# EasyEDA Pro project ProProject_PowerDistribution_1.1.epro

# Schematic Distribution

## Sheets
1 P1: Create Date: 2023-12-11; Page Name: P1; Project Name: PowerDistribution; Schematic Name: EXTERN; Update Date: 2024-01-13; Company: INNOX; Drawed: qianwan; Page Size: A4; Reviewed: qianwan; Version: V1.1
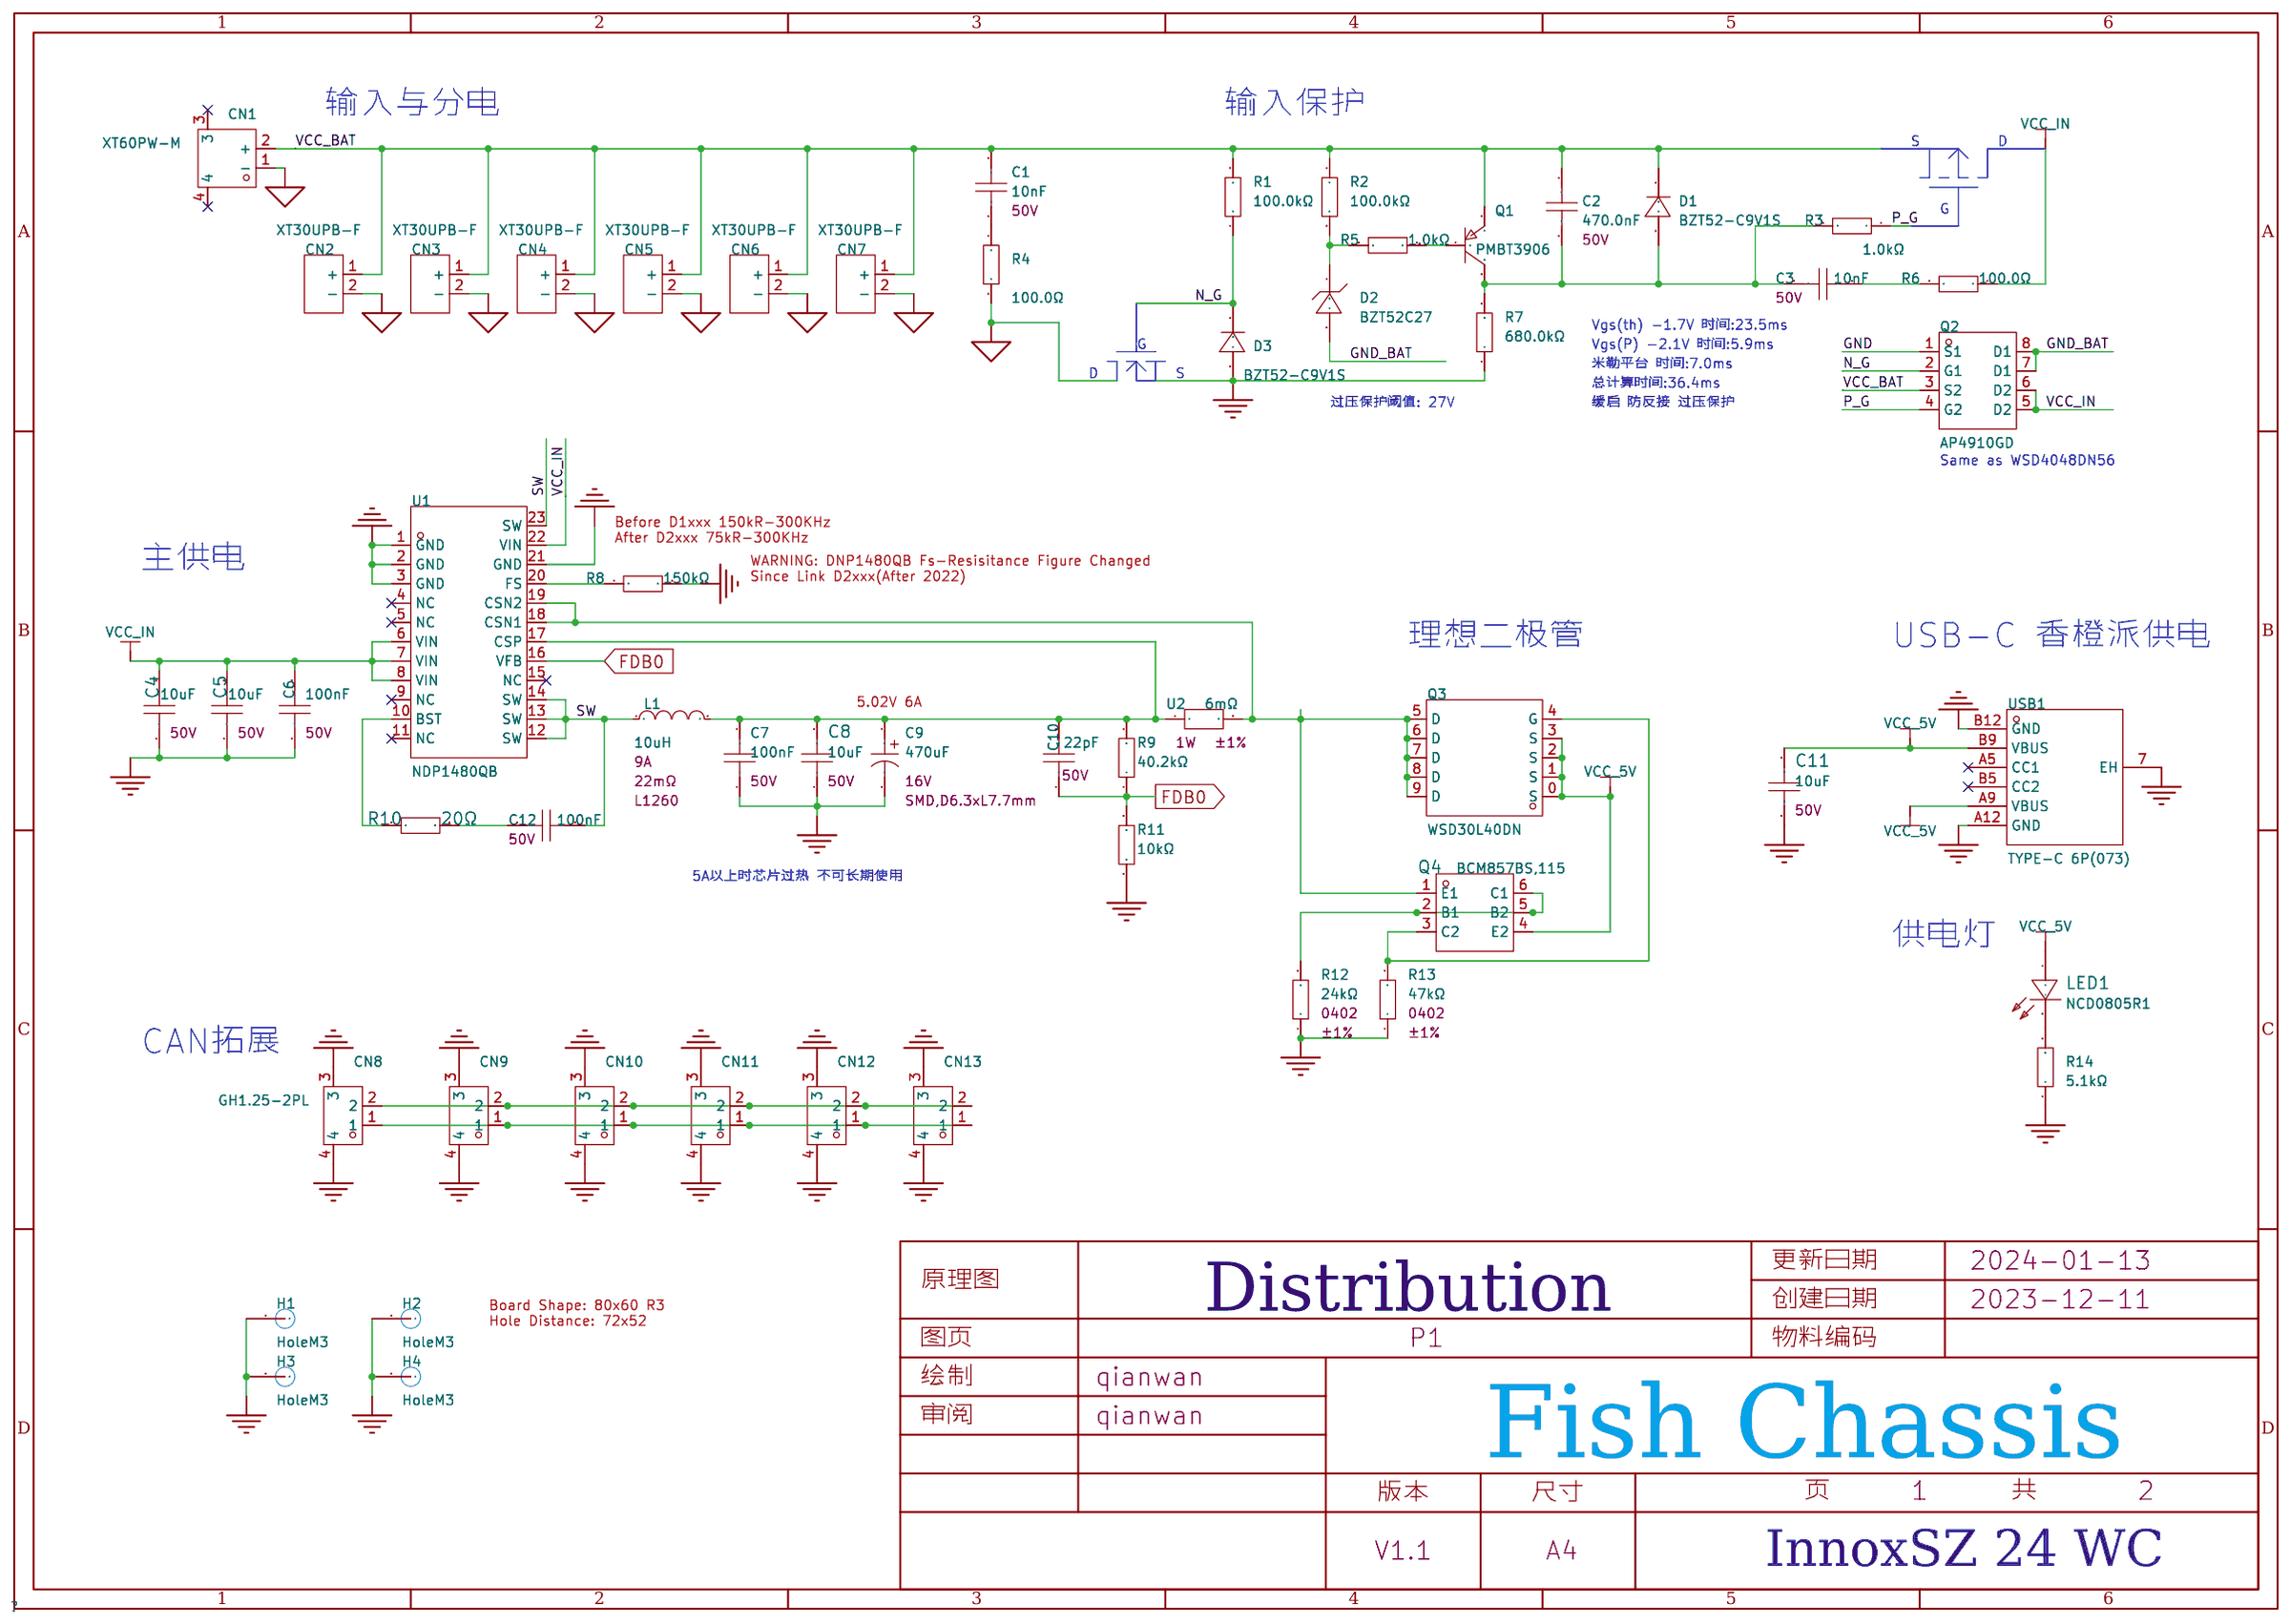
[diagram p0: P1]
2 P2: Create Date: 2023-12-13; Page Name: P2; Update Date: 2023-12-29
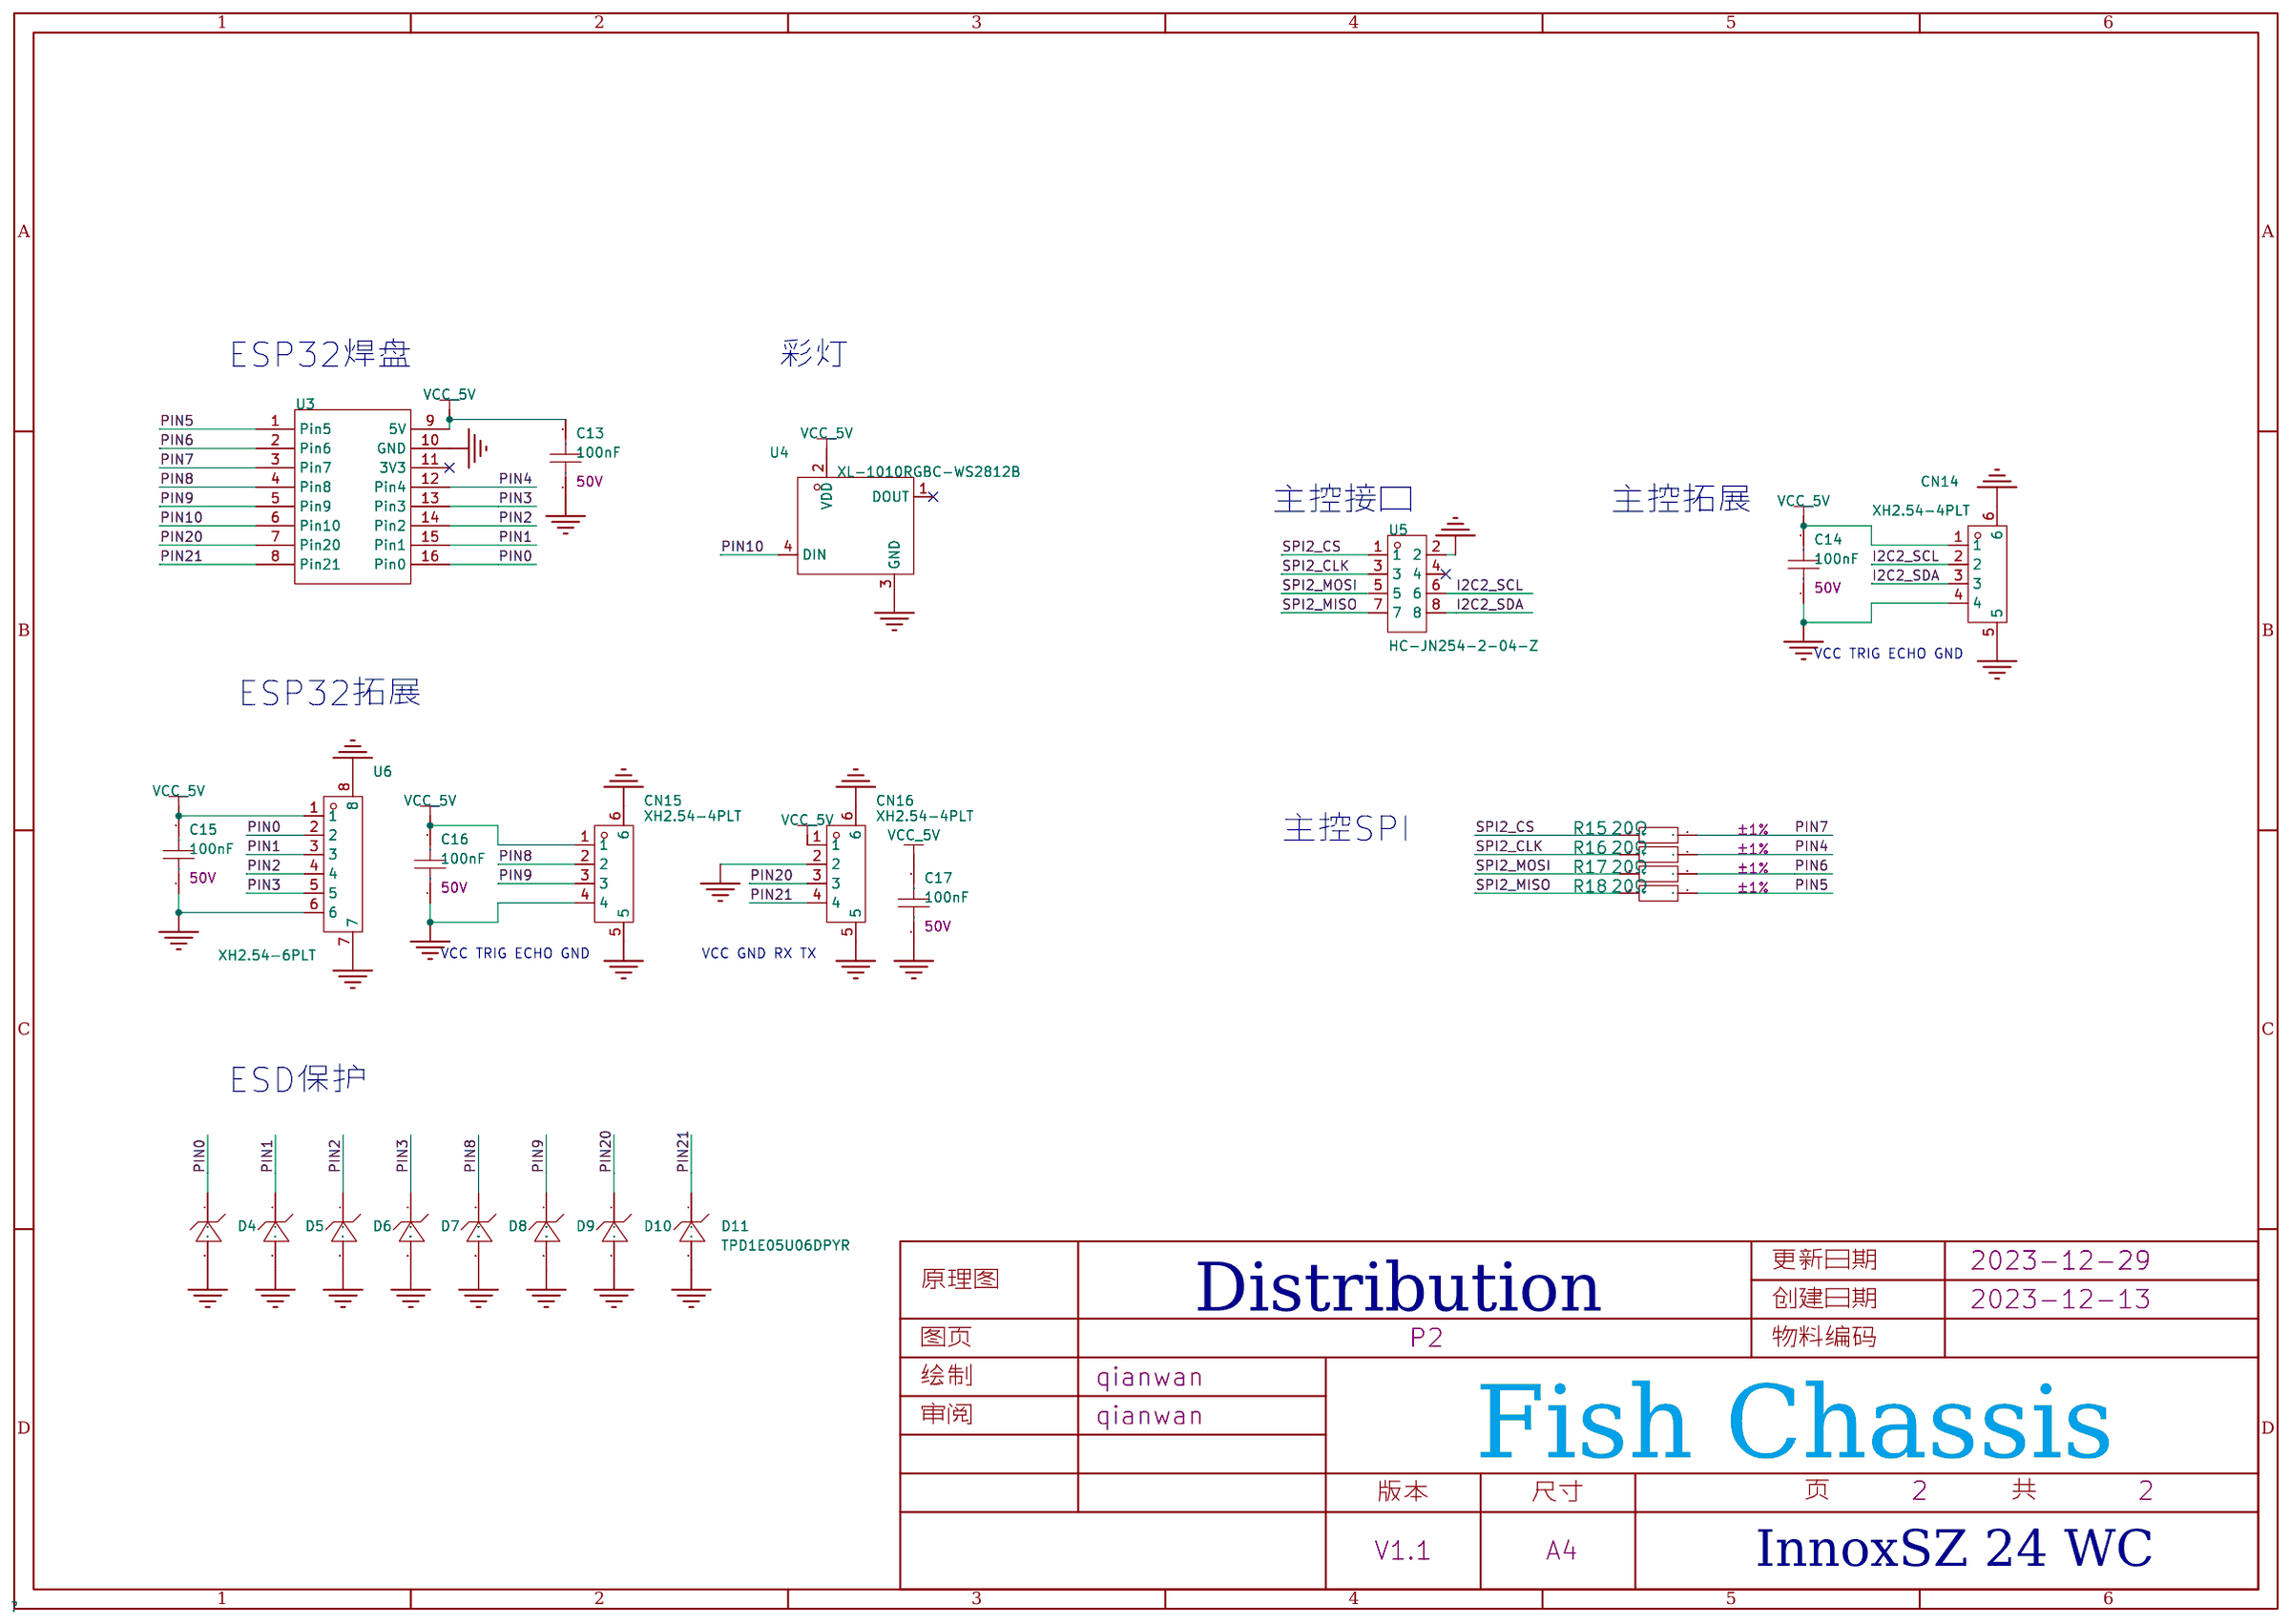
[diagram p1: P2]

## Parts
sheet P1
C1  10nF  [C0402]
C2  470.0nF  [C0402]
C3  10nF  [C0402]
C4  10uF  [C1206]
C5  10uF  [C1206]
C6  100nF  [C0402]
C7  100nF  [C0402]
C8  10uF  [C1206]
C9  470uF  [CAP-SMD_BD6.3-L6.6-W6.6-LS7.6-RD]
C10  22pF  [C0402]
C11  10uF  [C1206]
C12  100nF  [C0402]
CN1  XT60PW-M  [CONN-TH_XT60PW-M]
CN2  XT30UPB-F  [CONN-TH_XT30UPB-F]
CN3  XT30UPB-F  [CONN-TH_XT30UPB-F]
CN4  XT30UPB-F  [CONN-TH_XT30UPB-F]
CN5  XT30UPB-F  [CONN-TH_XT30UPB-F]
CN6  XT30UPB-F  [CONN-TH_XT30UPB-F]
CN7  XT30UPB-F  [CONN-TH_XT30UPB-F]
CN8  GH1.25-2PL  [CONN-SMD_2P-P1.25_L125WVS-02PS]
CN9  L125WVS-02PS  [CONN-SMD_2P-P1.25_L125WVS-02PS]
CN10  L125WVS-02PS  [CONN-SMD_2P-P1.25_L125WVS-02PS]
CN11  L125WVS-02PS  [CONN-SMD_2P-P1.25_L125WVS-02PS]
CN12  L125WVS-02PS  [CONN-SMD_2P-P1.25_L125WVS-02PS]
CN13  L125WVS-02PS  [CONN-SMD_2P-P1.25_L125WVS-02PS]
D1  BZT52-C9V1S  [SOD-323_L1.8-W1.3-LS2.5-RD]
D2  BZT52C27  [SOD-123_L2.7-W1.6-LS3.7-RD]
D3  BZT52-C9V1S  [SOD-323_L1.8-W1.3-LS2.5-RD]
H1  HoleM3  [M3孔]
H2  HoleM3  [M3孔]
H3  HoleM3  [M3孔]
H4  HoleM3  [M3孔]
L1  10uH  [IND-SMD_L13.5-W12.8_TMPC1265HP]
LED1  NCD0805R1  [LED0805-R-RD]
Q1  PMBT3906  [SOT-23-3_L2.9-W1.3-P1.90-LS2.4-BR]
Q2  AP4910GD  [DFN-8_L5.8-W4.9-P1.27-LS6.0-BL]
Q3  WSD30L40DN  [DFN-8_L3.0-W3.0-P0.65-BL-A]
Q4  BCM857BS,115  [SOT-363_L2.0-W1.3-P0.65-LS2.1-BL]
R1  100.0kΩ  [R0402]
R2  100.0kΩ  [R0402]
R3  1.0kΩ  [R0402]
R4  100.0Ω  [R0402]
R5  1.0kΩ  [R0402]
R6  100.0Ω  [R0402]
R7  680.0kΩ  [R0402]
R8  150kΩ  [R0402]
R9  40.2kΩ  [R0402]
R10  20Ω  [R0402]
R11  10kΩ  [R0402]
R12  24kΩ  [R0402]
R13  47kΩ  [R0402]
R14  5.1kΩ  [R0402]
U1  NDP1480QB  [QFN-20_L5.0-W5.0-P0.80-TL-NDP1460QB]
U2  6mΩ  [R1206]
USB1  TYPE-C 6P(073)  [TYPE-C-SMD_TYPE-C-6P]
sheet P2
C13  100nF  [C0402]
C14  100nF  [C0402]
C15  100nF  [C0402]
C16  100nF  [C0402]
C17  100nF  [C0402]
CN14  XH2.54-4PLT  [CONN-SMD_4P-P2.50_XUNPU_WAFER-XH2.54-4PLB]
CN15  XH2.54-4PLT  [CONN-SMD_4P-P2.50_XUNPU_WAFER-XH2.54-4PLB]
CN16  XH2.54-4PLT  [CONN-SMD_4P-P2.50_XUNPU_WAFER-XH2.54-4PLB]
D4  TPD1E05U06DPYR  [X2SON-2_L1.0-W0.6-P0.70-RD]
D5  TPD1E05U06DPYR  [X2SON-2_L1.0-W0.6-P0.70-RD]
D6  TPD1E05U06DPYR  [X2SON-2_L1.0-W0.6-P0.70-RD]
D7  TPD1E05U06DPYR  [X2SON-2_L1.0-W0.6-P0.70-RD]
D8  TPD1E05U06DPYR  [X2SON-2_L1.0-W0.6-P0.70-RD]
D9  TPD1E05U06DPYR  [X2SON-2_L1.0-W0.6-P0.70-RD]
D10  TPD1E05U06DPYR  [X2SON-2_L1.0-W0.6-P0.70-RD]
D11  TPD1E05U06DPYR  [X2SON-2_L1.0-W0.6-P0.70-RD]
R15  20Ω  [R0402]
R16  20Ω  [R0402]
R17  20Ω  [R0402]
R18  20Ω  [R0402]
U3  -  [ESP32-C3-SuperMini]
U4  XL-1010RGBC-WS2812B  [LED-SMD_4P-L1.0-W1.0-TL_XL-1010RGBC-WS2812B]
U5  HC-JN254-2-04-Z  [IDC-TH_8P-P2.54-V-R2-C4-S2.54]
U6  XH2.54-6PLT  [COMM-SMD_6P-P2.50_SHOUHAN_2.54-6PLT]

## Library data of the parts
C1 C3 = GCM155R71H103KA55D: 容值:10nF;精度:±10%;额定电压:50V;材质(温度系数):X7R;; LCSC Part Name: 10nF ±10% 50V; Supplier Part: C91601; Manufacturer: muRata(村田); Supplier Footprint: 0402; Datasheet: https://atta.szlcsc.com/upload/public/pdf/source/20161226/1482720174418.pdf; Supplier: LCSC; Tolerance: ±10%; Voltage Rated: 50V; Temperature Coefficient: X7R
C2 = CC0402KRX7R8BB103: 容值:10nF;精度:±10%;额定电压:25V;材质(温度系数):X7R;; LCSC Part Name: 10nF ±10% 25V; Supplier Part: C327025; Manufacturer: YAGEO(国巨); Supplier Footprint: 0402; Datasheet: https://atta.szlcsc.com/upload/public/pdf/source/20181031/C327025_BF09B1A7BE38D1441B1B31A410B80C1A.pdf; Supplier: LCSC; Tolerance: ±10%; Voltage Rated: 50V; Temperature Coefficient: X7R
C4 C5 C8 C11 = GRM31CR61H106KA12L: 容值:10uF;精度:±10%;额定电压:50V;材质(温度系数):X5R;; LCSC Part Name: 10uF ±10% 50V; Supplier Part: C77092; Manufacturer: muRata(村田); Supplier Footprint: 1206; Datasheet: https://atta.szlcsc.com/upload/public/pdf/source/20200305/C490387_23319AE8C154DEB24C505E6C82A8106A.pdf; Supplier: LCSC; Tolerance: ±10%; Voltage Rated: 50V; Temperature Coefficient: X5R
C6 C7 C12-C17 = CL05B104KB54PNC: 容值:100nF;精度:±10%;额定电压:50V;材质(温度系数):X7R;; LCSC Part Name: 100nF ±10% 50V; Supplier Part: C307331; Manufacturer: SAMSUNG(三星); Supplier Footprint: 0402; JLCPCB Part Class: 基础库; Datasheet: https://atta.szlcsc.com/upload/public/pdf/source/20181009/C307331_222F7C870FD3EA5F46F538B483443886.pdf; Supplier: LCSC; Tolerance: ±10%; Voltage Rated: 50V; Temperature Coefficient: X7R
C9 = RVT1C471M0607: 容值:470uF;精度:±20%;额定电压:16V;纹波电流:185mA@120Hz;; LCSC Part Name: 470uF ±20% 16V; Supplier Part: C2977552; Manufacturer: ROQANG(容强); Supplier Footprint: SMD,D6.3xL7.7mm; Datasheet: https://atta.szlcsc.com/upload/public/pdf/source/20220223/DD822675CC1DF2F0C06D5C2255C9C2D9.pdf; Supplier: LCSC; Tolerance: ±20%; Rated Voltage: 16V; Ripple Current: 185mA@120Hz; φD: 6.3mm; L: 7.7mm; Lifetime @ Temp: 2000hrs@105℃; Operating Temperature: -40℃~+105℃
C10 = GRM1555C1H220JA01D: 容值:22pF;精度:±5%;额定电压:50V;材质(温度系数):C0G;; LCSC Part Name: 22pF ±5% 50V; Supplier Part: C76960; Manufacturer: muRata(村田); Supplier Footprint: 0402; Datasheet: https://atta.szlcsc.com/upload/public/pdf/source/20180307/C76960_15204091281871407748.pdf; Supplier: LCSC; Tolerance: ±5%; Voltage Rated: 50V; Temperature Coefficient: C0G
CN1 = XT60PW-M: 类别:-;类型1:-;; LCSC Part Name: AMASS(艾迈斯)航模插头xt60连接器150公母对接pw锂电池公头 板插卧式XT60PW-M; Supplier Part: C98732; Manufacturer: AMASS(艾迈斯); JLCPCB Part Class: 扩展库; Datasheet: https://atta.szlcsc.com/upload/public/pdf/source/20190916/C428722_DFF78979486FCB0B58C1FC563067EC88.pdf; Supplier: LCSC; Brand: 艾迈斯; Type: 卧式插头; Colour: 黄色; InterfaceType: 公头
CN2-CN7 = XT30UPB-F30.G.Y: 类别:-;类型1:-;; LCSC Part Name: AMASS(艾迈斯)直立焊板式连接器XT30UPB30-F.G.*; Supplier Part: C108769; Manufacturer: AMASS(艾迈斯); Datasheet: https://atta.szlcsc.com/upload/public/pdf/source/20220715/AFD68B9E8B6CA95A7295DBF4AF9325E4.pdf; Supplier: LCSC; Brand: 艾迈斯; Type: 航模插头; Colour: 黄色; RatedVoltage: DC 500V; InterfaceType: 母头; MetalMaterial: 镀金; InsulationMaterial: PA; RatedCurrent: 15A; contact resistance: 0.65mΩ
CN8-CN13 = L125WVS-02PS: 插针结构:1x2P;间距:1.25mm;安装方式:立贴;总PIN数:2P;排数:1;每排PIN数:2;额定电流:1A;工作温度范围:-40℃~+110℃;; LCSC Part Name: 1x2P 间距:1.25mm 立贴 GH1.25间距立式贴片 2P 连接器; Supplier Part: C2998795; Manufacturer: DEALON(德艺隆); Supplier Footprint: SMD,P=1.25mm; Datasheet: https://atta.szlcsc.com/upload/public/pdf/source/20220425/F8C01F9CB8873697297E333D30B44EFA.pdf; Supplier: LCSC; Pins Structure: 1x2P; Pitch: 1.25mm; Mounting Style: 立贴; Number of Pins: 2P; Number of Rows: 1; Number of PINs Per Row: 2; Current Rating (Max): 1A; Operating Temperature Range: -40℃~+110℃
D1 D3 = BZT52-C9V1S_R1_00001: 二极管配置:独立式;稳压值(标称值):9.1V;稳压值(范围):8.65V~9.56V;精度:-;功率:200mW;反向电流(Ir):100nA@7V;阻抗(Zzt):10Ω;; LCSC Part Name: 9.1V 200mW; Supplier Part: C313474; Manufacturer: PANJIT(强茂); Supplier Footprint: SOD-323; JLCPCB Part Class: 扩展库; Datasheet: https://atta.szlcsc.com/upload/public/pdf/source/20190402/C313474_9EFA1D71D7DB7ED4C152A7C51F8CAF55.pdf; Supplier: LCSC; Diode Configuration: 独立式; Zener Voltage (Nom): 9.1V; Zener Voltage (Range): 8.65V~9.56V; Power Dissipation: 200mW; Reverse Leakage Current (Ir): 100nA@7V; Zener Impedance (Zzt): 10Ω
D2 = BZT52C27_C81935: 二极管配置:独立式;稳压值(标称值):27V;稳压值(范围):25.1V~28.9V;精度:-;功率:350mW;反向电流(Ir):100nA@18.9V;阻抗(Zzt):80Ω;; LCSC Part Name: 27V 350mW; Supplier Part: C81935; Manufacturer: CJ(江苏长电/长晶); Supplier Footprint: SOD-123; JLCPCB Part Class: 扩展库; Datasheet: https://atta.szlcsc.com/upload/public/pdf/source/20170413/1492062904174.pdf; Supplier: LCSC; Diode Configuration: 独立式; Zener Voltage (Nom): 27V; Zener Voltage (Range): 25.1V~28.9V; Power Dissipation: 350mW; Reverse Leakage Current (Ir): 100nA@18.9V; Zener Impedance (Zzt): 80Ω
H1-H4 = M3孔
L1 = MWSA1205S-100MT: 类型:-;电感值:10uH;精度:±20%;额定电流:9A;饱和电流(Isat):12A;; LCSC Part Name: 10uH ±20% 12A; Supplier Part: C408516; Manufacturer: Sunlord(顺络); Supplier Footprint: SMD; Datasheet: https://atta.szlcsc.com/upload/public/pdf/source/20190729/C408516_E470FDAC0E4469CD6BC5DA4C4239DA9C.pdf; Supplier: LCSC; Tolerance: ±20%; Rated Current: 9A; Saturation Current (Isat): 12A; DC Resistance (DCR): 22mΩ; 其他描述: L1260
LED1 = NCD0805R1: 发光颜色:红灯;; LCSC Part Name: 红灯; Supplier Part: C84256; Manufacturer: 国星光电; Supplier Footprint: 0805; JLCPCB Part Class: Basic Part; Datasheet: https://atta.szlcsc.com/upload/public/pdf/source/20200820/C84256_F0A75A43B3EAD75808600A0514C76B99.pdf; Supplier: LCSC; Emitted Color: 红灯
Q1 = PMBT3906,215: 晶体管类型:PNP;集射极击穿电压(Vceo):40V;集电极电流(Ic):200mA;功率(Pd):250mW;直流电流增益(hFE@Ic,Vce):100@10mA,1V;; LCSC Part Name: PNP 40V 200mA; Supplier Part: C8670; Manufacturer: Nexperia(安世); Supplier Footprint: SOT-23; Datasheet: https://atta.szlcsc.com/upload/public/pdf/source/20130412/1457706600965.pdf; Supplier: LCSC; Transistor Type: PNP; Collector-Emitter Breakdown Voltage (Vceo): 40V; Collector Current (Ic): 200mA; Power Dissipation (Pd): 250mW; Collector Cut-Off Current (Icbo): 50nA; Collector-Emitter Saturation Voltage (VCE(sat)@Ic,Ib): 400mV@50mA,5mA; DC Current Gain (hFE@Ic,Vce): 100@10mA,1V; Transition Frequency (fT): 250MHz; Operating Temperature: +150℃@(Tj)
Q2 = AP4910GD: 类型:1个N沟道和1个P沟道;连续漏极电流(Id):-;功率(Pd):-;导通电阻(RDS(on)@Vgs,Id):-;阈值电压(Vgs(th)@Id):-;; LCSC Part Name: 1个N沟道和1个P沟道; Supplier Part: C2849573; Manufacturer: ALLPOWER(铨力); Supplier Footprint: DFN-8(4.9x5.8); JLCPCB Part Class: 扩展库; Datasheet: https://atta.szlcsc.com/upload/public/pdf/source/20210723/C2849573_4C092881E49D8B65965118F4F21242AC.pdf; Supplier: LCSC; Type: 1个N沟道和1个P沟道
Q3 = WSD30L40DN: 类型:P沟道;漏源电压(Vdss):30V;连续漏极电流(Id):40A;功率(Pd):32.9W;导通电阻(RDS(on)@Vgs,Id):14mΩ@10V,20A;; LCSC Part Name: P沟道 30V 40A; Supplier Part: C148390; Manufacturer: WINSOK(微硕); Supplier Footprint: DFN-8(3x3); Datasheet: https://atta.szlcsc.com/upload/public/pdf/source/20171122/C148390_15113333990061134035.pdf; Supplier: LCSC; Type: P沟道; Drain Source Voltage (Vdss): 30V; Continuous Drain Current (Id): 40A; Power Dissipation (Pd): 32.9W; Drain Source On Resistance (RDS(on)@Vgs,Id): 14mΩ@10V,20A; Gate Threshold Voltage (Vgs(th)@Id): 2.3V@250uA
Q4 = BCM857BS,115: 晶体管类型:2个PNP配对;集射极击穿电压(Vceo):45V;集电极电流(Ic):100mA;功率(Pd):300mW;直流电流增益(hFE@Ic,Vce):200@2mA,5V;; LCSC Part Name: 2个PNP配对 耐压:45V 电流:100mA; Supplier Part: C105887; Manufacturer: Nexperia(安世); Supplier Footprint: SOT-323-6; Datasheet: https://atta.szlcsc.com/upload/public/pdf/source/20200107/C105887_86E9989A2C6D7BFD107FE0D2C6B1BB93.pdf; Supplier: LCSC; Transistor Type: 2个PNP配对; Collector-Emitter Breakdown Voltage (Vceo): 45V; Collector Current (Ic): 100mA; Power Dissipation (Pd): 300mW; Collector Cut-Off Current (Icbo): 15nA; Collector-Emitter Saturation Voltage (VCE(sat)@Ic,Ib): 200mV@100mA,5mA; DC Current Gain (hFE@Ic,Vce): 200@2mA,5V; Transition Frequency (fT): 175MHz; Operating Temperature: +150℃@(Tj)
R1-R7 = RC0402FR-07100KL: 电阻类型:厚膜电阻;阻值:100kΩ;精度:±1%;功率:62.5mW;; LCSC Part Name: 100kΩ ±1% 62.5mW; Supplier Part: C60491; Manufacturer: YAGEO(国巨); Supplier Footprint: 0402; Datasheet: https://atta.szlcsc.com/upload/public/pdf/source/20170518/1495086055123.pdf; Supplier: LCSC; Type: 厚膜电阻; Tolerance: ±1%; Power(Watts): 62.5mW; Temperature Coefficient: ±100ppm/℃; Overload Voltage (Max): 50V; Operating Temperature Range: -55℃~+155℃
R8 = 0402WGF1503TCE: 电阻类型:厚膜电阻;阻值:150kΩ;精度:±1%;功率:62.5mW;; LCSC Part Name: 150kΩ ±1% 62.5mW; Supplier Part: C25755; Manufacturer: UNI-ROYAL(厚声); Supplier Footprint: 0402; Datasheet: https://atta.szlcsc.com/upload/public/pdf/source/20200306/C422600_1E6D84923E4A46A82E41ADD87F860B5C.pdf; Supplier: LCSC; Type: 厚膜电阻; Tolerance: ±1%; Power(Watts): 62.5mW; Temperature Coefficient: ±100ppm/℃; Overload Voltage (Max): 50V; Operating Temperature Range: -55℃~+155℃
R9 = 0402WGF4022TCE: 电阻类型:厚膜电阻;阻值:40.2kΩ;精度:±1%;功率:62.5mW;; LCSC Part Name: 40.2kΩ ±1% 62.5mW; Supplier Part: C25893; Manufacturer: UNI-ROYAL(厚声); Supplier Footprint: 0402; Datasheet: https://atta.szlcsc.com/upload/public/pdf/source/20200306/C422600_1E6D84923E4A46A82E41ADD87F860B5C.pdf; Supplier: LCSC; Type: 厚膜电阻; Tolerance: ±1%; Power(Watts): 62.5mW; Temperature Coefficient: ±100ppm/℃; Overload Voltage (Max): 50V; Operating Temperature Range: -55℃~+155℃
R10 R15-R18 = 0402WGF220JTCE: 电阻类型:厚膜电阻;阻值:22Ω;精度:±1%;功率:62.5mW;温度系数:±100ppm/℃;; LCSC Part Name: 厚膜电阻 22Ω ±1% 62.5mW; Supplier Part: C25092; Manufacturer: UNI-ROYAL(厚声); Manufacturer Part: 0402WGF200JTCE; Supplier Footprint: 0402; JLCPCB Part Class: 基础库; Datasheet: https://atta.szlcsc.com/upload/public/pdf/source/20200306/C422600_1E6D84923E4A46A82E41ADD87F860B5C.pdf; Supplier: LCSC; Type: 厚膜电阻; Tolerance: ±1%; Power(Watts): 62.5mW; Temperature Coefficient: ±100ppm/℃; Overload Voltage (Max): 50V; Operating Temperature Range: -55℃~+155℃
R11 R14 = RC0402FR-0710KL: 电阻类型:厚膜电阻;阻值:10kΩ;精度:±1%;功率:62.5mW;; LCSC Part Name: 10kΩ ±1% 62.5mW; Supplier Part: C60490; Manufacturer: YAGEO(国巨); Supplier Footprint: 0402; Datasheet: https://atta.szlcsc.com/upload/public/pdf/source/20170606/1496716515432.pdf; Supplier: LCSC; Type: 厚膜电阻; Tolerance: ±1%; Power(Watts): 62.5mW; Temperature Coefficient: ±100ppm/℃; Overload Voltage (Max): 50V; Operating Temperature Range: -55℃~+155℃
R12 = 0402WGF2402TCE: 电阻类型:厚膜电阻;阻值:24kΩ;精度:±1%;功率:62.5mW;温度系数:±100ppm/℃;; LCSC Part Name: 厚膜电阻 24kΩ ±1% 62.5mW; Supplier Part: C25769; Manufacturer: UNI-ROYAL(厚声); Supplier Footprint: 0402; JLCPCB Part Class: 扩展库; Datasheet: https://atta.szlcsc.com/upload/public/pdf/source/20200306/C422600_1E6D84923E4A46A82E41ADD87F860B5C.pdf; Supplier: LCSC; Type: 厚膜电阻; Tolerance: ±1%; Power(Watts): 62.5mW; Temperature Coefficient: ±100ppm/℃; Overload Voltage (Max): 50V; Operating Temperature Range: -55℃~+155℃
R13 = 0402WGF4702TCE: 电阻类型:厚膜电阻;阻值:47kΩ;精度:±1%;功率:62.5mW;温度系数:±100ppm/℃;; LCSC Part Name: 厚膜电阻 47kΩ ±1% 62.5mW; Supplier Part: C25792; Manufacturer: UNI-ROYAL(厚声); Supplier Footprint: 0402; Datasheet: https://atta.szlcsc.com/upload/public/pdf/source/20200306/C422600_1E6D84923E4A46A82E41ADD87F860B5C.pdf; Supplier: LCSC; Type: 厚膜电阻; Tolerance: ±1%; Power(Watts): 62.5mW; Temperature Coefficient: ±100ppm/℃; Overload Voltage (Max): 50V; Operating Temperature Range: -55℃~+155℃
U1 = NDP1480QB_Correct: Supplier Part: C7420585; Manufacturer: NDP(芯潭微); Supplier Footprint: QFN-20-EP(5x5); Datasheet: https://atta.szlcsc.com/upload/public/pdf/source/20230612/FD40F0CA84FC8C78706CD05106E72DC0.pdf; Supplier: LCSC
U2 = PA1206FRF470R006L: 阻值:6mΩ;精度:±1%;功率:1W;温度系数:±100ppm/℃;; LCSC Part Name: 6mΩ ±1% 1W; Supplier Part: C728286; Manufacturer: YAGEO(国巨); Supplier Footprint: 1206; Datasheet: https://atta.szlcsc.com/upload/public/pdf/source/20201130/C728286_DEAF20F559CA24F3AA17D725FFEA2298.pdf; Supplier: LCSC; Tolerance: ±1%; Power(Watts): 1W; Temperature Coefficient: ±100ppm/℃
USB1 = TYPE-C 6P(073): 连接器类型:Type-C;标准:-;公母:母;触点数量:6P;端口数量:1;安装方式:卧贴;额定电流 - 电源:5A;工作温度范围:-25℃~+85℃;; LCSC Part Name: Type-C 母 卧贴; Supplier Part: C668623; Manufacturer: SHOU HAN(首韩); Supplier Footprint: SMD; Datasheet: https://atta.szlcsc.com/upload/public/pdf/source/20200618/C668623_A4B260DED7AC1949BAC6AE39E9F4CD80.pdf; Supplier: LCSC; Connector Type: Type-C; Gender: 母; Number of Contacts: 6P; Number of Ports: 1; Mounting Style: 卧贴; Current Rating - Power (Max): 5A; Operating Temperature Range: -25℃~+85℃
CN14-CN16 = WAFER-XH2.54-4PLB: 插针结构:1x4P;间距:2.5mm;安装方式:立贴;总PIN数:4P;排数:1;每排PIN数:4;额定电流:3A;工作温度范围:-25℃~+85℃;; LCSC Part Name: 1x4P 间距:2.5mm 立贴 加盖; Supplier Part: C3029469; Manufacturer: XUNPU(讯普); Supplier Footprint: SMD,P=2.5mm; Datasheet: https://atta.szlcsc.com/upload/public/pdf/source/20220527/139842C6548CEDBA8D9F0F4A441614CD.pdf; Supplier: LCSC; Pins Structure: 1x4P; Pitch: 2.5mm; Mounting Style: 立贴; Number of Pins: 4P; Number of Rows: 1; Number of PINs Per Row: 4; Current Rating (Max): 3A; Operating Temperature Range: -25℃~+85℃
D4-D11 = TPD1E05U06DPYR: 反向截止电压(Vrwm):5.5V@Max;最大钳位电压:14V;峰值脉冲电流(Ipp)@10/1000us:2.5A@8/20us;击穿电压:6V;; Supplier Part: C436349; Manufacturer: TI(德州仪器); Supplier Footprint: X2-SON-2(0.6x1); Datasheet: https://www.ti.com/cn/lit/gpn/tpd1e05u06; Supplier: LCSC; Reverse Stand-Off Voltage (Vrwm): 5.5V@Max; Maximum Clamping Voltage: 14V; Peak Pulse Current (Ipp)@10/1000us: 2.5A@8/20us; Breakdown Voltage: 6V; Type: TVS
U3 = ESP32-C3-SuperMini: NoneName ESP32-C3-SuprMini Module
U4 = XL-1010RGBC-WS2812B: 发光颜色:RGB三色;功率:-;透镜颜色:无色透明透镜;主波长:465nm~475nm；520nm~530nm；620nm~625nm;发光强度:300mcd；800mcd；200mcd;发光角度:120°;安装方式:正贴;工作温度:-40℃~+150℃;; LCSC Part Name: RGB三色 光强200mcd;800mcd;300mcd 正贴 0404幻彩; Supplier Part: C5349953; Manufacturer: XINGLIGHT(成兴光); Supplier Footprint: 1010; Datasheet: https://atta.szlcsc.com/upload/public/pdf/source/20230111/7F92487BABF607E2EE42D1D66EFE1A21.pdf; Supplier: LCSC; Emitted Color: RGB三色; Forward Voltage (VF): 3.5V~5.5V; Forward Current: 20mA; Lens Color: 无色透明透镜; Dominant Wavelength: 465nm~475nm；520nm~530nm；620nm~625nm; Luminous Intensity: 300mcd；800mcd；200mcd; Viewing Angle: 120°; Mounting Sytle: 正贴; Operating Temperature: -40℃~+150℃
U5 = HC-JN254-2-04-Z: 连接器类型:简牛座;每排PIN数:4;结构:2x4P;排数:2;间距:2.54mm;行距:2.54mm;封装形式:直插;额定电流:3A;额定电压:-;触头材质:铜;触头镀层:金;工作温度范围:-40℃~+105℃;焊接温度(最大值):-;; LCSC Part Name: 每排P数:4 2x4P 排数:2 2.54mm; Supplier Part: C5372864; Manufacturer: HCTL(华灿天禄); Supplier Footprint: 插件,P=2.54mm; Datasheet: https://atta.szlcsc.com/upload/public/pdf/source/20230314/29278A24539954283B80828B9C32CD4C.pdf; Supplier: LCSC; Connector Type: 简牛座; Pin Number in each Row: 4; Structure: 2x4P; Number of Rows: 2; Pitch: 2.54mm; Row Spacing: 2.54mm; Holder Type: 直插; Current Rating (Max): 3A; Contact Material: 铜; Contact Plating: 金; Operating Temperature Range: -40℃~+105℃
U6 = 2.54-6PLT: 插针结构:1x6P;间距:2.5mm;公母:公;安装方式:立贴;排数:1;每排PIN数:6;额定电流:3A;工作温度范围:-25℃~+105℃;; LCSC Part Name: 1x6P 间距:2.5mm 立贴 2.54间距 6P立贴; Supplier Part: C3008581; Manufacturer: SHOU HAN(首韩); Supplier Footprint: SMD,P=2.5mm; Datasheet: https://atta.szlcsc.com/upload/public/pdf/source/20220427/8578EABF9A46EEA284DC639AA6283DD7.pdf; Supplier: LCSC; Pins Structure: 1x6P; Pitch: 2.5mm; Gender: 公; Mounting Style: 立贴; Number of Rows: 1; Number of PINs Per Row: 6; Current Rating (Max): 3A; Operating Temperature Range: -25℃~+105℃

## Nets
GND: C4.1 C5.1 C6.1 C7.1 C8.1 C9.2 C11.1 C13.1 C14.1 C15.1 C16.1 C17.1 CN8.3 CN8.4 CN9.3 CN9.4 CN10.3 CN10.4 CN11.3 CN11.4 CN12.3 CN12.4 CN13.3 CN13.4 CN14.4 CN14.5 CN14.6 CN15.4 CN15.5 CN15.6 CN16.2 CN16.5 CN16.6 D3.2(A) D4.2(GND) D5.2(GND) D6.2(GND) D7.2(GND) D8.2(GND) D9.2(GND) D10.2(GND) D11.2(GND) H1.1 H2.1 H3.1 H4.1 Q2.1(S1) R7.1 R8.2 R11.1 R12.1 R13.1 R14.1 U1.1(GND) U1.2(GND) U1.3(GND) U1.21(GND) U3.10(GND) U4.3(GND) U5.2 U6.6 U6.7 U6.8 USB1.7(EH) USB1.A12(GND) USB1.B12(GND)
GND_BAT: CN1.1(-) CN2.2(-) CN3.2(-) CN4.2(-) CN5.2(-) CN6.2(-) CN7.2(-) D2.2(A) Q2.7(D1) Q2.8(D1) R4.2
VCC_5V: C11.2 C13.2 C14.2 C15.2 C16.2 C17.2 CN14.1 CN15.1 CN16.1 LED1.1(+) Q3.0(S) Q3.1(S) Q3.2(S) Q3.3(S) Q4.4(E2) U3.9(5V) U4.2(VDD) U6.1 USB1.A9(VBUS) USB1.B9(VBUS)
VCC_BAT: C1.2 C2.1 CN1.2(+) CN2.1(+) CN3.1(+) CN4.1(+) CN5.1(+) CN6.1(+) CN7.1(+) D1.1(C) Q1.2(E) Q2.3(S2) R1.2 R2.1
VCC_IN: C4.2 C5.2 C6.2 Q2.5(D2) Q2.6(D2) R6.1 U1.6(VIN) U1.7(VIN) U1.8(VIN) U1.22(VIN)
FDB0: C10.1 R9.1 R11.2 U1.16(VFB)
I2C2_SCL: CN14.2 U5.6
I2C2_SDA: CN14.3 U5.8
N_G: D3.1(C) Q2.2(G1) R1.1
P_G: Q2.4(G2) R3.1
PIN0: D4.1(I/O) U3.16(Pin0) U6.2
PIN1: D5.1(I/O) U3.15(Pin1) U6.3
PIN2: D6.1(I/O) U3.14(Pin2) U6.4
PIN3: D7.1(I/O) U3.13(Pin3) U6.5
PIN4: R16.2 U3.12(Pin4)
PIN5: R18.2 U3.1(Pin5)
PIN6: R17.2 U3.2(Pin6)
PIN7: R15.2 U3.3(Pin7)
PIN8: CN15.2 D8.1(I/O) U3.4(Pin8)
PIN9: CN15.3 D9.1(I/O) U3.5(Pin9)
PIN10: U3.6(Pin10) U4.4(DIN)
PIN20: CN16.3 D10.1(I/O) U3.7(Pin20)
PIN21: CN16.4 D11.1(I/O) U3.8(Pin21)
SPI2_CLK: R16.1 U5.3
SPI2_CS: R15.1 U5.1
SPI2_MISO: R18.1 U5.7
SPI2_MOSI: R17.1 U5.5
SW: C12.2 L1.1 U1.12(SW) U1.13(SW) U1.14(SW) U1.23(SW)
$1N2108: C1.1 R4.1
$1N2110: C3.1 R6.2
$1N2113: D2.1(C) R2.2 R5.2
$1N2132: C2.2 C3.2 D1.2(A) Q1.3(C) R3.2 R7.2
$1N2133: Q1.1(B) R5.1
$1N3207: R10.1 U1.10(BST)
$1N3208: C12.1 R10.2
$1N3212: R8.1 U1.20(FS)
$1N3229: Q3.4(G) Q4.3(C2) R13.2
$1N3230: Q4.2(B1) Q4.5(B2) Q4.6(C1) R12.2
$1N3527: Q3.5(D) Q3.6(D) Q3.7(D) Q3.8(D) Q3.9(D) Q4.1(E1) U1.18(CSN1) U1.19(CSN2) U2.2
$1N3528: C7.2 C8.2 C9.1 C10.2 L1.2 R9.2 U1.17(CSP) U2.1
$1N7013: CN8.2 CN9.2 CN10.2 CN11.2 CN12.2 CN13.2
$1N7021: CN8.1 CN9.1 CN10.1 CN11.1 CN12.1 CN13.1
$1N7183: LED1.2(-) R14.2

Not connected (* = marked no-connect by the designer): CN1 3* 4*; U1 4(NC)* 5(NC)* 9(NC)* 11(NC)* 15(NC)*; U3 11(3V3)*; U4 1(DOUT)*; U5 4*; USB1 A5(CC1)* B5(CC2)*

## Notes on the sheets
sheet 1
- 输入与分电
- 输入保护
- S
- D
- G
- Vgs(th) -1.7V 时间:23.5ms
- G
- Vgs(P) -2.1V 时间:5.9ms
- D
- S
- 米勒平台 时间:7.0ms
- 过压保护阈值: 27V
- 总计算时间:36.4ms
- 缓启 防反接 过压保护
- Same as WSD4048DN56
- Before D1xxx 150kR-300KHz
  After D2xxx 75kR-300KHz
- 主供电
- WARNING: DNP1480QB Fs-Resisitance Figure Changed
  Since Link D2xxx(After 2022)
- 理想二极管
- USB-C 香橙派供电
- 5.02V 6A
- 5A以上时芯片过热 不可长期使用
- 供电灯
- CAN拓展
- Board Shape: 80x60 R3
  Hole Distance: 72x52
- Distribution
- Fish Chassis
- InnoxSZ 24 WC
sheet 2
- ESP32焊盘
- 彩灯
- 主控接口
- 主控拓展
- VCC TRIG ECHO GND
- ESP32拓展
- 主控SPI
- VCC TRIG ECHO GND
- VCC GND RX TX
- ESD保护
- Distribution
- Fish Chassis
- InnoxSZ 24 WC

# Board PCB1
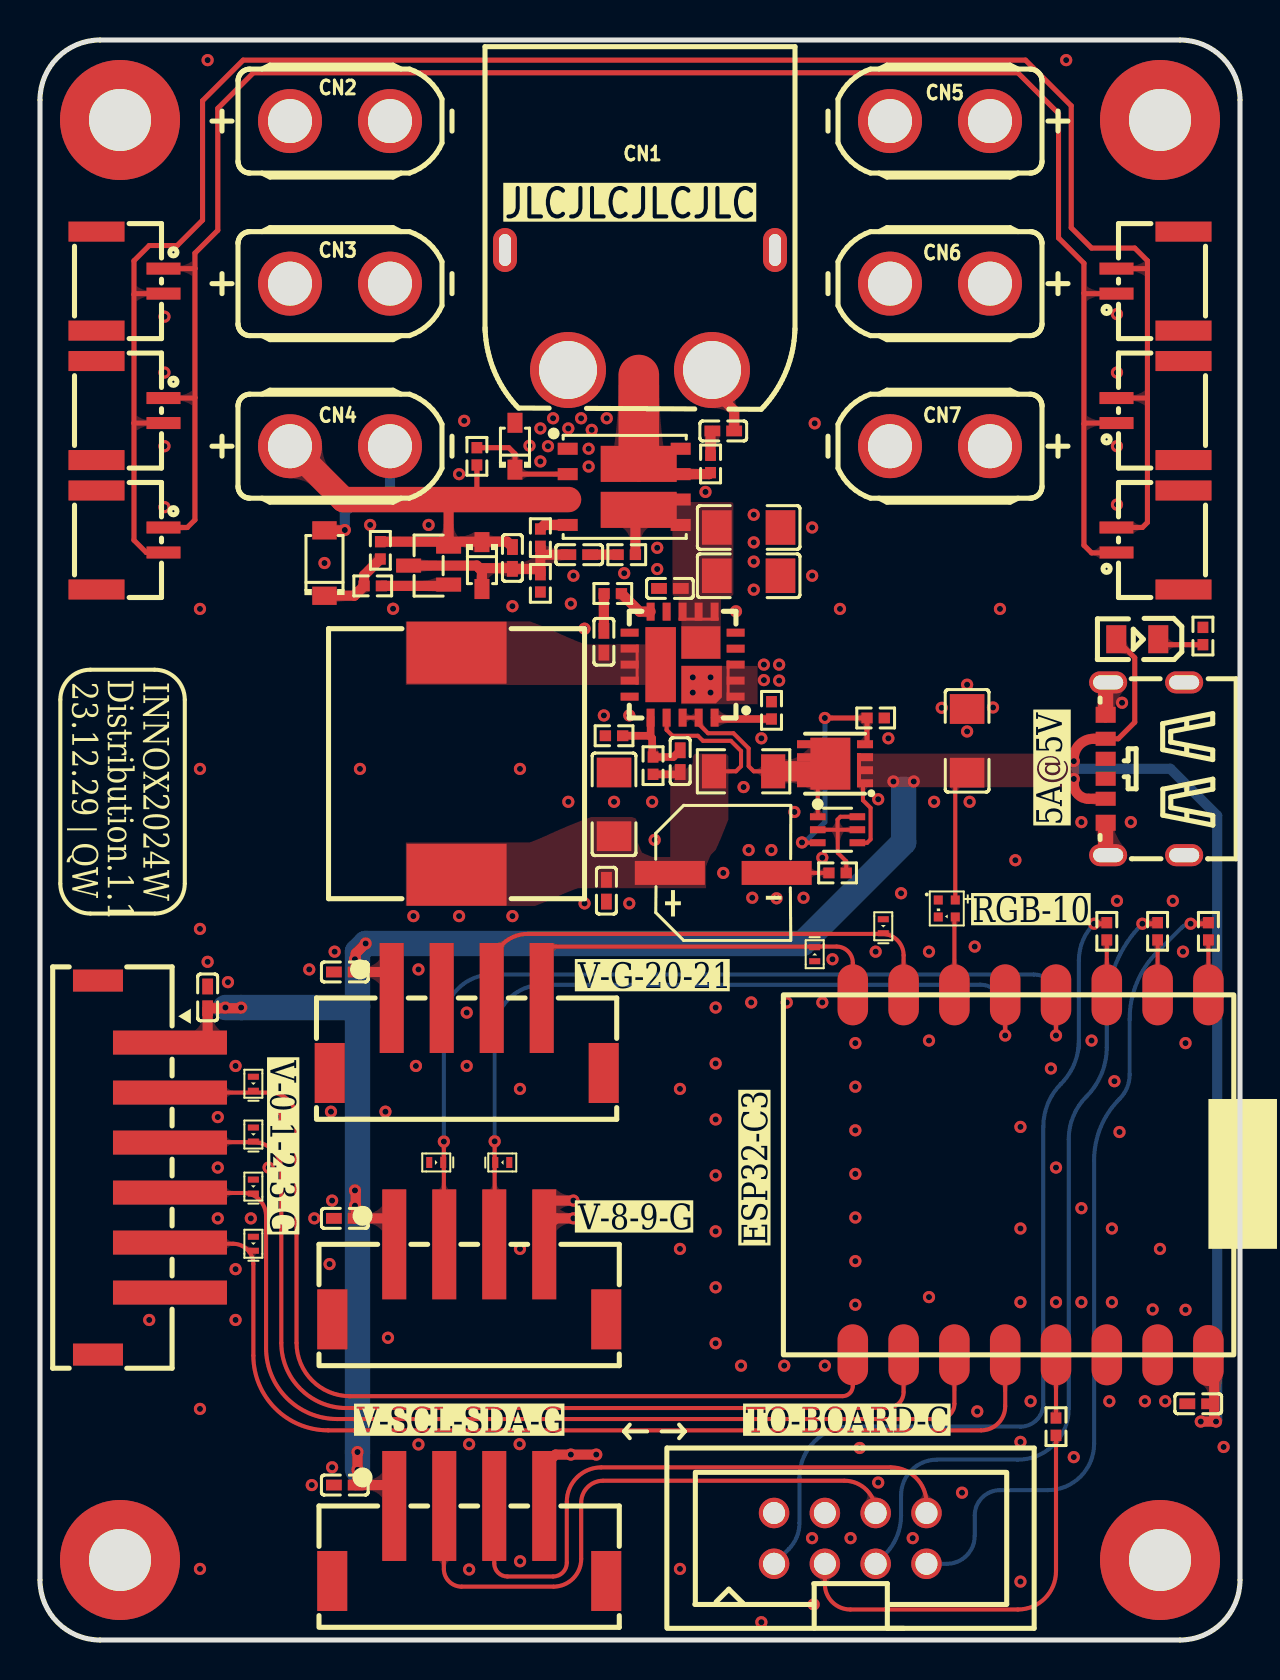
[diagram p2: board, top side]
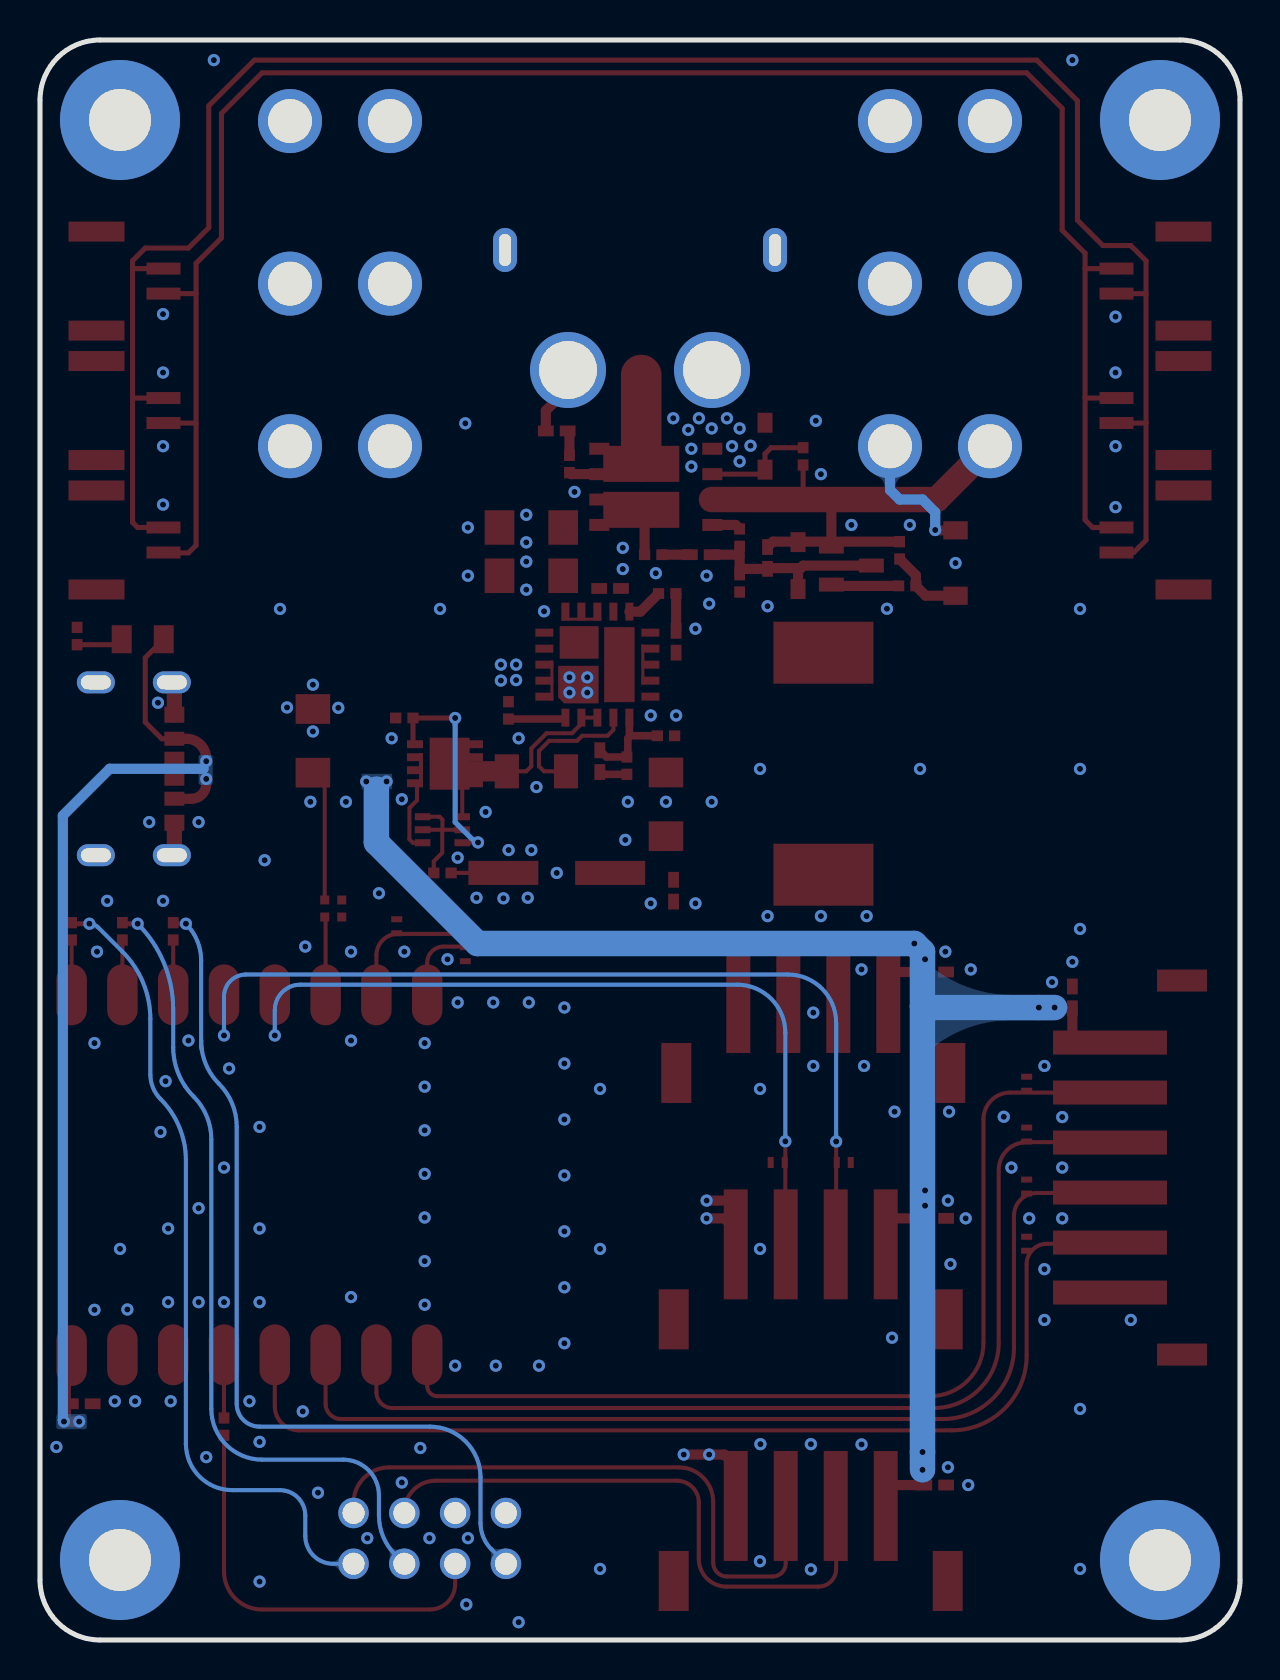
[diagram p3: board, bottom side, seen from below]

Outline 60 x 80 mm; copper layers: Top Layer, Bottom Layer. Coordinates in mm from the lower left corner of the outline.
Outline path: 0,77 0,3 arc(0.88,0.88) 3,0 57,0 arc(59.12,0.88) 60,3 60,77 arc(59.12,79.12) 57,80 3,80 arc(0.88,79.12) 0,77
Stack: Top Layer 0.035mm / Dielectric1 1.51mm FR4 er 4.5 / Bottom Layer 0.035mm

## Design rules (mm)
template: 自定义配置
spacing copperThickness1oz (default): track to track 0.102, other pairs 0.152 to 0.3
spacing copperThickness2oz: track to track 0.203, other pairs 0.152 to 0.3
track width copperThickness1oz (default): min 0.127, default 0.254, max 2.54
track width copperThickness2oz: min 0.203, default 0.254, max 2.54
differential pair differentialPair (default): width min 0.127, default 0.254, max 2.54; gap min 0.152, default 0.152
via viaSize (default): diameter min 0.5, default 0.61, max 10; hole min 0.3, default 0.305, max 6.299
pour e284 uses copperPower
pour e8196 uses copperPower
pour e8195 uses copperPower
pour e10623 uses copperPower
pour e10626 uses copperPower
pour e11264 uses copperPower
pour e404 uses copperRegion
pour e618 uses copperRegion

## Placement (name value [footprint] x y rotation side)
C1  10nF  [C0402]  34.16 60.45 0 top
C2  470.0nF  [C0402]  23.62 54.1 270 top
C3  10nF  [C0402]  26.96 54.27 180 top
C4  10uF  [C1206]  35.43 55.63 180 top
C5  10uF  [C1206]  35.43 53.21 180 top
C6  100nF  [C0402]  31.5 52.58 0 top
C7  100nF  [C0402]  28.32 37.47 90 top
C8  10uF  [C1206]  28.7 41.78 270 top
C9  470uF  [CAP-SMD_BD6.3-L6.6-W6.6-LS7.6-RD]  34.16 38.35 0 top
C10  22pF  [C0402]  32.01 43.94 270 top
C11  10uF  [C1206]  46.35 44.96 270 top
C12  100nF  [C0402]  28.19 49.91 270 top
C13  100nF  [C0402]  57.91 11.81 0 top
C14  100nF  [C0402]  15.24 7.75 0 top
C15  100nF  [C0402]  8.38 32.13 270 top
C16  100nF  [C0402]  15.24 21.08 0 top
C17  100nF  [C0402]  15.24 33.4 0 top
CN1  XT60PW-M  [CONN-TH_XT60PW-M]  30 66.5 270 top
CN2  XT30UPB-F  [CONN-TH_XT30UPB-F]  15 75.95 0 top
CN3  XT30UPB-F  [CONN-TH_XT30UPB-F]  15 67.82 0 top
CN4  XT30UPB-F  [CONN-TH_XT30UPB-F]  15 59.69 0 top
CN5  XT30UPB-F  [CONN-TH_XT30UPB-F]  45 75.95 180 top
CN6  XT30UPB-F  [CONN-TH_XT30UPB-F]  45 67.82 180 top
CN7  XT30UPB-F  [CONN-TH_XT30UPB-F]  45 59.69 180 top
CN8  GH1.25-2PL  [CONN-SMD_2P-P1.25_L125WVS-02PS]  4.5 67.94 270 top
CN9  L125WVS-02PS  [CONN-SMD_2P-P1.25_L125WVS-02PS]  4.5 61.47 270 top
CN10  L125WVS-02PS  [CONN-SMD_2P-P1.25_L125WVS-02PS]  4.5 55 270 top
CN11  L125WVS-02PS  [CONN-SMD_2P-P1.25_L125WVS-02PS]  55.5 67.94 90 top
CN12  L125WVS-02PS  [CONN-SMD_2P-P1.25_L125WVS-02PS]  55.5 55 90 top
CN13  L125WVS-02PS  [CONN-SMD_2P-P1.25_L125WVS-02PS]  55.5 61.47 90 top
CN14  XH2.54-4PLT  [CONN-SMD_4P-P2.50_XUNPU_WAFER-XH2.54-4PLB]  21.46 4.83 0 top
CN15  XH2.54-4PLT  [CONN-SMD_4P-P2.50_XUNPU_WAFER-XH2.54-4PLB]  21.46 17.91 0 top
CN16  XH2.54-4PLT  [CONN-SMD_4P-P2.50_XUNPU_WAFER-XH2.54-4PLB]  21.34 30.23 0 top
D1  BZT52-C9V1S  [SOD-323_L1.8-W1.3-LS2.5-RD]  22.1 53.72 270 top
D2  BZT52C27  [SOD-123_L2.7-W1.6-LS3.7-RD]  14.22 53.85 90 top
D3  BZT52-C9V1S  [SOD-323_L1.8-W1.3-LS2.5-RD]  23.75 59.69 90 top
D4  TPD1E05U06DPYR  [X2SON-2_L1.0-W0.6-P0.70-RD]  10.67 27.81 90 top
D5  TPD1E05U06DPYR  [X2SON-2_L1.0-W0.6-P0.70-RD]  10.67 25.27 90 top
D6  TPD1E05U06DPYR  [X2SON-2_L1.0-W0.6-P0.70-RD]  10.67 22.67 90 top
D7  TPD1E05U06DPYR  [X2SON-2_L1.0-W0.6-P0.70-RD]  10.67 19.81 90 top
D8  TPD1E05U06DPYR  [X2SON-2_L1.0-W0.6-P0.70-RD]  19.81 23.88 180 top
D9  TPD1E05U06DPYR  [X2SON-2_L1.0-W0.6-P0.70-RD]  23.11 23.88 0 top
D10  TPD1E05U06DPYR  [X2SON-2_L1.0-W0.6-P0.70-RD]  42.16 35.69 90 top
D11  TPD1E05U06DPYR  [X2SON-2_L1.0-W0.6-P0.70-RD]  38.74 34.29 270 top
H1  HoleM3  [M3孔]  4 76 0 top
H2  HoleM3  [M3孔]  56 76 0 top
H3  HoleM3  [M3孔]  4 4 0 top
H4  HoleM3  [M3孔]  56 4 0 top
L1  10uH  [IND-SMD_L13.5-W12.8_TMPC1265HP]  20.83 43.81 270 top
LED1  NCD0805R1  [LED0805-R-RD]  54.86 50.04 180 top
Q1  PMBT3906  [SOT-23-3_L2.9-W1.3-P1.90-LS2.4-BR]  19.43 53.72 0 top
Q2  AP4910GD  [DFN-8_L5.8-W4.9-P1.27-LS6.0-BL]  29.21 57.66 270 top
Q3  WSD30L40DN  [DFN-8_L3.0-W3.0-P0.65-BL-A]  39.75 43.81 90 top
Q4  BCM857BS,115  [SOT-363_L2.0-W1.3-P0.65-LS2.1-BL]  39.88 40.51 270 top
R1  100.0kΩ  [R0402]  21.84 59.18 270 top
R2  100.0kΩ  [R0402]  17.02 54.48 270 top
R3  1.0kΩ  [R0402]  25.02 55.12 270 top
R4  100.0Ω  [R0402]  33.53 58.8 270 top
R5  1.0kΩ  [R0402]  16.64 52.7 180 top
R6  100.0Ω  [R0402]  29.34 54.27 180 top
R7  680.0kΩ  [R0402]  25.02 52.83 90 top
R8  150kΩ  [R0402]  36.58 46.48 90 top
R9  40.2kΩ  [R0402]  30.65 43.72 270 top
R10  20Ω  [R0402]  28.64 52.32 180 top
R11  10kΩ  [R0402]  28.7 45.21 0 top
R12  24kΩ  [R0402]  39.88 38.35 0 top
R13  47kΩ  [R0402]  41.78 46.1 180 top
R14  5.1kΩ  [R0402]  58.15 50.2 270 top
R15  20Ω  [R0402]  53.34 35.43 270 top
R16  20Ω  [R0402]  50.8 10.67 90 top
R17  20Ω  [R0402]  55.88 35.43 270 top
R18  20Ω  [R0402]  58.42 35.43 270 top
U1  NDP1480QB  [QFN-20_L5.0-W5.0-P0.80-TL-NDP1460QB]  32.13 48.77 180 top
U2  6mΩ  [R1206]  35.18 43.43 0 top
U3  -  [ESP32-C3-SuperMini]  59.69 32.26 270 top
U4  XL-1010RGBC-WS2812B  [LED-SMD_4P-L1.0-W1.0-TL_XL-1010RGBC-WS2812B]  45.34 36.58 0 top
U5  HC-JN254-2-04-Z  [IDC-TH_8P-P2.54-V-R2-C4-S2.54]  40.51 5.08 0 top
U6  XH2.54-6PLT  [COMM-SMD_6P-P2.50_SHOUHAN_2.54-6PLT]  4.7 23.62 270 top
USB1  TYPE-C 6P(073)  [TYPE-C-SMD_TYPE-C-6P]  55.25 43.56 90 top

## Footprints (pads in the part's own frame, mm; a bottom-side part is the same pattern mirrored in y, then rotated)
C0402
  rect 0.79x0.54 smd: 1(-0.545,0) 2(0.545,0)
C1206
  rect 1.485x1.728 smd: 1(-1.593,0) 2(1.593,0)
CAP-SMD_BD6.3-L6.6-W6.6-LS7.6-RD
  rect 3.5x1.2 smd: 1(-2.67,0) 2(2.67,0)
COMM-SMD_6P-P2.50_SHOUHAN_2.54-6PLT
  rect 1.2x5.7 smd: 1(-6.25,1.8) 2(-3.75,1.8) 3(-1.25,1.8) 4(1.25,1.8) 5(3.75,1.8) 6(6.25,1.8)
  rect 1.1x2.5 smd: 7(9.35,-1.8) 8(-9.35,-1.8)
CONN-SMD_2P-P1.25_L125WVS-02PS
  rect 0.6x1.7 smd: 1(-0.625,1.675) 2(0.625,1.675)
  rect 1x2.8 smd: 3(-2.475,-1.675) 4(2.475,-1.675)
CONN-SMD_4P-P2.50_XUNPU_WAFER-XH2.54-4PLB
  rect 1.2x5.5 smd: 1(-3.75,1.875) 2(-1.25,1.875) 3(1.25,1.875) 4(3.75,1.875)
  rect 1.5x3 smd: 5(6.85,-1.875) 6(-6.85,-1.875)
CONN-TH_XT30UPB-F
  round 3.2 hole 2.2: 1(-2.5,0) 2(2.5,0)
CONN-TH_XT60PW-M
  round 3.8 hole 2.9: 1(3,-3.6) 2(3,3.6)
  oval 2.2x1.2 hole 1.6x0.6: 3(-3,6.75) 4(-3,-6.75)
DFN-8_L3.0-W3.0-P0.65-BL-A
  custom 1.7x0.2 smd: 0(-0.326,-1.198)
  rect 0.4x0.8 smd: 1(-0.975,-1.5) 2(-0.325,-1.5) 3(0.325,-1.5) 4(0.975,-1.5) 5(0.975,1.5) 6(0.325,1.5) 7(-0.325,1.5) 8(-0.975,1.5)
  rect 2.6x2 smd: 9(0,0.233)
DFN-8_L5.8-W4.9-P1.27-LS6.0-BL
  rect 0.6x1 smd: 1(-1.905,-2.825) 2(-0.635,-2.825) 3(0.635,-2.825) 4(1.905,-2.825) 5(1.905,2.825) 6(0.635,2.825) 7(-0.635,2.825) 8(-1.905,2.825)
  rect 1.8x3.8 smd: 6(1.15,0.725) 8(-1.15,0.725)
ESP32-C3-SuperMini
  oval 3.048x1.524 smd: 1(0,-1.27) 2(0,-3.81) 3(0,-6.35) 4(0,-8.89) 5(0,-11.43) 6(0,-13.97) 7(0,-16.51) 8(0,-19.05) 9(18.034,-1.27) 10(18,-3.81) 11(18,-6.35) 12(18,-8.89) 13(18,-11.43) 14(18,-13.97) 15(18,-16.51) 16(18,-19.05)
IDC-TH_8P-P2.54-V-R2-C4-S2.54
  round 1.524 hole 1.1: 1(-3.81,-1.27) 2(-3.81,1.27) 3(-1.27,-1.27) 4(-1.27,1.27) 5(1.27,-1.27) 6(1.27,1.27) 7(3.81,-1.27) 8(3.81,1.27)
IND-SMD_L13.5-W12.8_TMPC1265HP
  rect 3.1x5 smd: 1(-5.55,0) 2(5.55,0)
LED0805-R-RD
  rect 1x1.399 smd: 1(1.05,0) 2(-1.05,0)
LED-SMD_4P-L1.0-W1.0-TL_XL-1010RGBC-WS2812B
  rect 0.45x0.45 smd: 1(-0.425,0.424) 2(0.425,0.425) 3(-0.425,-0.425) 4(0.425,-0.425)
M3孔
  round 6 hole 3.1: 1(0,0)
QFN-20_L5.0-W5.0-P0.80-TL-NDP1460QB
  rect 0.9x0.4 smd: 1(-2.65,1.6) 2(-2.65,0.8) 3(-2.65,0) 4(-2.65,-0.8) 5(-2.65,-1.6) 11(2.65,-1.6) 12(2.65,-0.8) 13(2.65,0) 14(2.65,0.8) 15(2.65,1.6)
  custom 0.15x2 smd: 3(-2.275,0.8) 14(2.275,0)
  rect 0.4x0.9 smd: 6(-1.6,-2.65) 7(-0.8,-2.65) 8(0,-2.65) 9(0.8,-2.65) 10(1.6,-2.65) 16(1.6,2.65) 17(0.8,2.65) 18(0,2.65) 19(-0.8,2.65) 20(-1.6,2.65)
  custom 2x0.15 smd: 8(-0.799,-2.275)
  custom 2.025x1.875 smd: 21(-0.95,1)
  custom 1.95x1.625 smd: 22(-0.912,-1.11)
  custom 1.525x3.75 smd: 23(1.1,0)
R0402
  rect 0.566x0.54 smd: 1(-0.433,0) 2(0.433,0)
R1206
  rect 1.208x1.701 smd: 1(-1.479,0) 2(1.479,0)
SOD-123_L2.7-W1.6-LS3.7-RD
  rect 0.91x1.22 smd: 1(-1.635,0) 2(1.635,0)
SOD-323_L1.8-W1.3-LS2.5-RD
  rect 1x0.75 smd: 1(-1.173,0) 2(1.173,0)
SOT-23-3_L2.9-W1.3-P1.90-LS2.4-BR
  rect 1.25x0.7 smd: 1(1,-0.95) 2(1,0.95) 3(-1,0)
SOT-363_L2.0-W1.3-P0.65-LS2.1-BL
  rect 0.35x0.78 smd: 1(-0.65,-0.99) 2(0,-0.99) 3(0.65,-0.99) 4(0.65,0.99) 5(0,0.99) 6(-0.65,0.99)
TYPE-C-SMD_TYPE-C-6P
  oval 1.1x1.9 hole 0.7x1.5: 7(-4.32,1.837) 7(-4.32,-1.962) 7(4.32,1.837) 7(4.32,-1.962)
  rect 0.7x1 smd: A5(-0.5,1.962) A9(1.5,1.962) B5(0.5,1.962) B9(-1.5,1.962)
  rect 0.8x1 smd: A12(2.7,1.962) B12(-2.7,1.962)
X2SON-2_L1.0-W0.6-P0.70-RD
  rect 0.3x0.55 smd: 1(-0.35,0) 2(0.35,0)

## Nets
As in the schematic.

Pads without a net: CN1 3 4; U1 4 5 9 11 15; U3 11; U4 1; U5 4; USB1 A5 B5

## Via types
v1: diameter 0.61, hole 0.305, Top Layer to Bottom Layer, 203 vias
v2: diameter 0.61, hole 0.304, Top Layer to Bottom Layer, 18 vias

## Routing (per net, layer and track width the routed paths; a pad name or vN(x,y) marks a point on that pad's centre or on a via; arc(x,y) is an arc through that point)
GND: length 15.9
  Top Layer w0.203: R12.1 C9.2
  Top Layer w0.508: CN14.4 25.21,8.7 25.78,9.27 v1(26.54,9.27) v1(27.81,9.27) ; v1(26.67,21.08) 25.78,21.08 25.21,20.51 ; 25.21,20.51 CN15.4 ; 25.21,20.51 25.21,21.53 25.65,21.97 v1(26.67,21.97)
  Top Layer w0.762: 53.28,46.26 53.28,47.76 arc(53.32,47.84) USB1.7 ; USB1.B12 53.28,39.37 arc(53.32,39.28) 53.41,39.24
  vias: v1(5.46,16) v1(6.22,66.17) v1(6.22,63.37) v1(6.22,59.69) v1(6.22,56.64) v1(8.38,78.99) v1(8.38,33.91) v1(8.89,26.15) v1(8.89,23.62) v1(8.89,21.08) v1(9.4,32.89) v1(9.78,28.7) v1(9.78,18.54) v1(9.78,16) v1(10.54,21.08) v1(11.43,23.62) v1(11.81,26.16) v1(13.46,33.53) v1(13.59,7.75) v1(13.72,21.08) v1(14.22,53.85) v1(14.55,26.42) v1(14.48,18.8) v1(14.6,21.97) v1(14.6,8.64) v1(14.73,34.42) v1(16.51,55.75) v1(17.27,26.42) v1(17.4,15.11) v1(17.65,51.56) v1(18.67,36.19) v1(18.8,28.7) v1(18.92,33.53) v1(18.92,9.78) v1(19.43,55.75) v1(20.96,58.29) v1(20.96,36.19) v1(21.21,60.96) v1(21.34,31.37) v1(21.34,28.7) v1(21.46,9.79) v1(21.46,3.53) v1(23.62,51.69) v1(23.62,36.19) v1(23.98,9.79) v1(24,3.94) v1(24.47,59.72) v1(25.02,60.58) v1(25.02,58.93) v1(25.4,59.69) v1(25.65,61.09) v1(26.42,60.58) v1(26.42,41.91) v1(26.54,51.82) v1(26.67,53.21) v1(27.06,61.09) v1(27.23,50.56) v1(27.23,36.83) v1(27.43,59.56) v1(27.43,58.67) v1(27.59,60.51) v1(28.19,46.23) v1(28.34,61.09) v1(28.7,41.91) v1(29.21,53.34) v1(29.46,46.23) v1(29.46,36.83) v1(30.61,41.91) v1(30.73,40) v1(30.86,54.61) v1(30.86,53.55) v1(32.64,48.13) v1(32.64,47.37) v1(33.27,57.4) v1(33.53,48.13) v1(33.53,47.37) v1(33.78,31.62) v1(33.78,28.83) v1(33.78,26.03) v1(33.78,23.23) v1(33.78,20.43) v1(33.78,17.63) v1(33.78,14.84) v1(34.16,38.35) v1(34.8,51.44) v1(35.05,13.72) v1(35.18,42.65) v1(35.43,39.5) v1(35.61,37.11) v1(35.56,31.88) v1(35.69,56.26) v1(35.69,54.88) v1(35.69,53.92) v1(35.69,52.52) v1(36.07,45.08) v1(36.07,0.89) v1(36.19,48.77) v1(36.19,47.99) v1(36.57,39.5) v1(36.83,37.08) v1(36.96,48.77) v1(36.96,47.97) v1(37.21,13.72) v1(37.34,31.88) v1(37.72,41.4) v1(38.18,37.11) v1(38.61,55.63) v1(38.61,53.21) v1(38.6,5.09) v1(38.74,60.83) v1(38.68,1.78) v1(39.12,39.12) v1(39.12,31.88) v1(39.24,13.72) v1(39.62,34.04) v1(40.53,5.09) v1(40.77,29.84) v1(40.77,25.48) v1(40.77,23.3) v1(40.77,21.12) v1(40.77,16.76) v1(40.99,9.6) v1(41.78,34.42) v1(41.91,42.04) v1(41.91,7.87) v1(42.42,45.08) v1(43.05,37.34) v1(43.64,5.09) v1(44.45,34.42) v1(44.45,29.97) v1(44.45,17.15) v1(44.7,41.91) v1(45.09,46.61) v1(46.1,7.37) v1(46.35,47.77) v1(46.35,45.43) v1(46.48,41.91) v1(46.74,34.67) v1(46.86,11.43) v1(47.65,46.63) v1(48.77,38.99) v1(49.02,25.65) v1(49.02,20.57) v1(49.02,16.89) v1(49.02,9.91) v1(49.02,2.92) v1(49.53,11.94) v1(50.8,23.62) v1(50.8,16.89) v1(51.31,78.99) v1(51.69,9.14) v1(52.07,40.89) v1(52.07,21.59) v1(52.07,16.89) v1(52.58,29.97) v1(53.47,11.94) v1(53.59,20.57) v1(53.59,16.89) v1(53.72,27.94) v1(53.85,66.29) v1(53.85,63.37) v1(53.85,59.69) v1(53.85,56.77) v1(53.85,36.96) v1(53.97,25.4) v1(54.1,46.86) v1(54.54,40.89) v1(55.25,11.94) v1(55.63,16.53) v1(56.26,11.94) v1(56.64,36.96) v1(57.15,34.42) v1(57.28,29.84) v1(57.28,16.51) v1(59.18,9.65) v2(8,51.56) v2(8,43.56) v2(8,35.56) v2(8,11.56) v2(8,3.56) v2(16,43.56) v2(24,43.56) v2(24,27.56) v2(24,19.56) v2(32,27.56) v2(32,19.56) v2(32,3.56) v2(40,51.56) v2(40.77,27.67) v2(40.77,18.94) v2(48,51.56) v2(50.55,28.58) v2(56,19.56)
GND_BAT: length 12.7
  Top Layer w0.508: D2.2 15.22,55.48 v1(15.24,55.5) ; 31.99,58.29 33.45,58.29 R4.2
  Top Layer w2.032: 29.94,58.93 29.94,63.25
  Bottom Layer w0.508: CN4.2 17.5,57.5 17.02,57.02 15.88,57.02 15.24,56.39 v1(15.24,55.5)
VCC_5V: length 146.2
  Top Layer w0.203: Q3.1 41.15,42.74 41.15,41.99 41.53,41.61 41.53,40.03 41.36,39.86 Q4.4 ; U4.2 45.76,42.93
  Top Layer w0.254: USB1.A9 53.91,45.06 54.74,45.89 54.74,49.11 LED1.1
  Top Layer w0.508: CN15.1 17.71,21.02 17.65,21.08 C16.2 15.78,22.44 v1(15.75,22.48) ; v1(58.04,10.92) 58.69,10.92 ; 58.69,10.92 v1(58.8,10.92) ; 58.69,10.92 58.71,10.94 58.71,14.19 58.67,14.22 ; USB1.B9 52.43,42.06 arc(51.91,42.28) 51.69,42.8 ; CN16.1 17.59,33.09 17.27,33.4 C17.2 15.78,34.33 v1(16.28,34.82) ; v1(15.88,9.4) v1(15.88,8.51) 15.88,7.84 C14.2 17.53,7.75 17.71,7.56 CN14.1 ; v1(10.06,31.62) 10.02,31.59 C15.2 8.38,30.1 8.16,29.87 U6.1 ; USB1.A9 52.68,45.06 arc(51.98,44.77) 51.69,44.07
  Bottom Layer w0.508: 51.82,43.56 56.51,43.56 58.86,41.22 58.86,11 58.79,10.93
  Bottom Layer w1.27: 15.88,31.68 15.88,34.42 v1(16.28,34.82) 38.13,34.82 43.18,39.88 43.18,42.55 ; 15.88,31.68 15.82,31.62 v1(10.06,31.62) v1(9.27,31.62) ; 15.88,31.68 v1(15.88,9.4) v1(15.88,8.51)
  vias: v1(15.75,34.04) v1(15.75,21.72) v1(42.67,42.93) v1(43.69,42.93) v1(51.69,43.94) v1(51.69,43.05)
VCC_BAT: length 28.6
  Top Layer w0.254: R1.2 21.84,57.4
  Top Layer w0.508: C1.2 34.71,61.47 33.6,62.58 CN1.2 ; 20.43,54.92 20.43,56.64 ; 20.43,54.92 Q1.2 ; 20.43,54.92 23.35,54.92 C2.1 ; 20.43,54.92 R2.1
  Top Layer w1.27: CN4.1 15.17,57.02 26.43,57.02
VCC_IN: length 2.2
  Top Layer w0.508: 29.94,56.39 29.77,56.22 R6.1
FDB0: length 4.9
  Top Layer w0.381: R11.2 30.48,45.21 30.53,45.16 ; C10.1 31.67,44.15 R9.1 30.61,44.2 30.61,45.08 30.53,45.16 ; U1.16 30.53,45.16
I2C2_SCL: length 30.4
  Top Layer w0.203: U5.6 41.78,6.4 arc(41.33,7.51) 40.22,7.96 28.16,7.96 arc(27.38,7.64) 27.06,6.87 27.06,4.06 arc(26.65,3.07) 25.67,2.67 21.08,2.67 arc(20.45,2.93) 20.19,3.56 20.19,6.68 arc(20.2,6.7) CN14.2
I2C2_SDA: length 30.8
  Top Layer w0.203: U5.8 44.32,6.85 arc(43.8,8.11) 42.54,8.63 28.06,8.63 arc(26.84,8.13) 26.34,6.91 26.34,3.86 arc(26.14,3.38) 25.65,3.18 23.37,3.18 arc(22.9,3.37) 22.71,3.83 CN14.3
N_G: length 5.6
  Top Layer w0.254: R1.1 23.44,59.61 23.75,59.31 D3.1 23.97,58.29 26.43,58.29
P_G: length 1.5
  Top Layer w0.508: 26.43,55.75 25.22,55.75 R3.1
PIN0: length 49.5
  Top Layer w0.203: U3.16 40.64,12.7 arc(40.49,12.34) 40.13,12.19 15.49,12.19 arc(13.61,12.97) 12.83,14.86 12.83,26.03 arc(12.44,26.98) 11.49,27.37 U6.2 arc(6.52,27.41) 6.56,27.43
PIN1: length 50.3
  Top Layer w0.203: U3.15 43.18,12.4 arc(42.94,11.83) 42.38,11.6 15.33,11.6 arc(13.02,12.55) 12.06,14.86 12.06,23.5 arc(11.66,24.48) 10.67,24.89 6.52,24.89 arc(6.5,24.89) U6.3
PIN2: length 51.4
  Top Layer w0.203: U3.14 45.72,11.81 arc(45.5,11.27) 44.96,11.05 14.86,11.05 arc(12.34,12.09) 11.3,14.6 11.3,21.21 arc(11.12,21.83) 10.63,22.25 arc(10.4,22.33) 10.16,22.35 6.52,22.35 arc(6.5,22.36) U6.4
PIN3: length 52.3
  Top Layer w0.203: U3.13 48.26,11.68 arc(47.91,10.83) 47.06,10.48 14.41,10.48 arc(11.76,11.58) 10.67,14.22 10.67,18.8 arc(10.37,19.51) 9.65,19.81 6.56,19.81 arc(6.52,19.83) U6.5
PIN4: length 3.2
  Top Layer w0.203: R16.2 U3.12
PIN5: length 2.7
  Top Layer w0.203: U3.1 R18.2
PIN6: length 2.7
  Top Layer w0.203: R17.2 U3.2
PIN7: length 2.7
  Top Layer w0.203: R15.2 U3.3
PIN8: length 47.7
  Top Layer w0.203: v1(50.8,30.23) U3.4 ; v1(20.19,24.92) 20.19,19.8 arc(20.2,19.79) CN15.2
  Bottom Layer w0.203: v1(50.8,30.23) 50.8,32.17 arc(50.48,32.95) 49.7,33.27 22.61,33.27 arc(20.9,32.57) 20.19,30.86 v1(20.19,24.92)
PIN9: length 41.5
  Top Layer w0.203: v1(48.26,30.23) U3.5 ; v1(22.73,24.93) 22.73,19.8 arc(22.73,19.79) CN15.3
  Bottom Layer w0.203: v1(48.26,30.23) 48.26,31.5 arc(47.89,32.39) 46.99,32.77 25.15,32.77 arc(23.44,32.06) 22.73,30.35 v1(22.73,24.93)
PIN10: length 3.9
  Top Layer w0.203: U3.6 45.72,36.11 arc(45.73,36.14) U4.4
PIN20: length 25.6
  Top Layer w0.203: CN16.3 22.59,33.51 arc(23.11,34.78) 24.38,35.31 42.11,35.31 arc(42.87,34.99) 43.18,34.23 U3.7
PIN21: length 19.9
  Top Layer w0.203: U3.8 40.64,33.86 arc(40.4,34.43) 39.83,34.67 25.61,34.67 arc(25.15,34.48) 24.96,34.02 24.96,32.23
SPI2_CLK: length 21.2
  Top Layer w0.203: R16.1 50.8,3.43 arc(50.24,2.08) 48.9,1.52 40.51,1.52 arc(39.61,1.9) 39.24,2.79 U5.3
SPI2_CS: length 44.9
  Top Layer w0.254: v1(52.71,35.81) 53.29,35.81 arc(53.32,35.83) R15.1
  Bottom Layer w0.203: 51.94,29.96 51.94,33.97 arc(52.14,34.97) v1(52.71,35.81) ; 51.94,29.96 51.94,29.72 arc(51.93,29.6) 51.91,29.48 ; 51.94,29.96 arc(51.93,29.72) 51.91,29.48 ; U5.1 37.43,4.54 arc(37.83,5.14) 37.97,5.84 37.97,8.13 arc(38.72,9.92) 40.51,10.67 49.02,10.67 arc(49.83,11) 50.16,11.81 50.16,25.67 arc(50.4,26.83) 51.05,27.81 arc(51.61,28.58) 51.91,29.48
SPI2_MISO: length 40.9
  Top Layer w0.254: v1(57.53,35.81) 58.37,35.81 arc(58.4,35.83) R18.1
  Bottom Layer w0.203: 52.71,9.78 52.71,9.81 ; 52.71,9.81 52.71,23.98 arc(53.04,25.64) 53.97,27.05 arc(54.35,27.61) 54.48,28.28 54.48,31.04 arc(54.85,32.87) 55.88,34.42 57.1,35.63 arc(57.3,35.77) v1(57.53,35.81) ; 52.71,9.81 arc(52.03,8.17) 50.39,7.49 48.01,7.49 arc(47.11,7.12) 46.74,6.22 46.74,5.21 arc(46.33,4.22) 45.34,3.81 U5.7
SPI2_MOSI: length 40.7
  Top Layer w0.254: v1(55.12,35.81) 55.83,35.81 arc(55.86,35.83) R17.1
  Bottom Layer w0.203: U5.5 42.25,4.27 arc(42.84,5.17) 43.05,6.22 43.05,7.23 arc(43.58,8.49) 44.84,9.02 48.9,9.02 arc(50.69,9.76) 51.44,11.56 51.44,25.03 arc(51.67,26.19) 52.32,27.18 arc(52.55,27.43) 52.76,27.71 arc(53.19,28.63) 53.34,29.63 53.34,31.52 arc(53.8,33.84) v1(55.12,35.81)
$1N2108: length 1.3
  Top Layer w0.508: C1.1 33.53,60.36 R4.1
$1N2110: length 1.4
  Top Layer w0.508: C3.1 R6.2
$1N2113: length 3.9
  Top Layer w0.508: D2.1 15.71,52.21 R5.2 16.2,53.24 R2.2
$1N2132: length 10.6
  Top Layer w0.508: Q1.3 21.84,53.72 21.97,53.59 ; D1.2 22.1,53.47 21.97,53.59 ; 21.97,53.59 23.59,53.59 C2.2 25,53.56 25.02,53.58 ; 25.02,54.22 25.02,53.58 ; 25.02,54.22 R3.2 ; 25.02,54.22 25.06,54.27 C3.2 ; 25.02,53.58 R7.2
$1N2133: length 3.4
  Top Layer w0.508: Q1.1 20.37,52.7 R5.1
$1N3207: length 1.8
  Top Layer w0.508: R10.1 29.98,51.42 U1.10
$1N3208: length 1.9
  Top Layer w0.508: 28.21,52.32 28.19,52.31 C12.1
$1N3212: length 2.9
  Top Layer w0.381: R8.1 33.8,46.05 U1.20
$1N3229: length 11
  Top Layer w0.203: Q4.3 38.12,39.86 arc(38.1,39.87) v1(38.1,39.88)
  Top Layer w0.254: v1(38.1,39.88) 38.12,39.86 ; v1(39.24,46.1) R13.2 41.35,44.89 Q3.4
  Bottom Layer w0.254: v1(38.1,39.88) 38.23,39.88 39.24,40.89 v1(39.24,46.1)
$1N3230: length 5.9
  Top Layer w0.203: 40.31,38.35 40.31,38.94 39.89,39.36 39.89,40.51 ; Q4.6 40.02,41.16 39.88,41.02 39.88,40.52 39.89,40.51 ; 39.89,40.51 Q4.5 ; 39.89,40.51 Q4.2
$1N3527: length 12.4
  Top Layer w0.203: Q4.1 38.89,43.19 arc(38.9,43.31) 38.94,43.43 arc(39.17,43.71) Q3.9 ; U1.18 U1.19 32.93,45.81 33.4,45.34 34.67,45.34 35.43,44.58 35.43,43.69 35.69,43.43 U2.2
  Top Layer w1.016: U2.2 39.14,43.43 Q3.9
$1N3528: length 8.4
  Top Layer w0.203: U2.1 34.8,43.43 35.05,43.69 35.05,44.45 34.54,44.96 33.15,44.96 32.89,45.21 31.62,45.21 31.33,45.5 U1.17
  Top Layer w0.381: R9.2 31.9,43.28 arc(31.98,43.32) C10.2
$1N7013: length 102.6
  Top Layer w0.254: CN10.2 5.31,54.38 4.7,54.99 4.7,60.84 ; 4.7,67.28 4.74,67.32 CN8.2 ; 4.7,67.28 4.7,68.96 5.46,69.72 6.86,69.72 8.13,70.99 8.13,76.96 10.16,78.99 49.28,78.99 51.56,76.71 51.56,70.61 52.58,69.6 54.74,69.6 55.37,68.96 55.37,68.59 ; 4.7,67.28 4.7,60.84 ; 55.37,68.59 55.36,68.57 CN11.2 ; 55.37,68.59 55.37,62.1 ; CN9.2 4.71,60.85 4.7,60.84 ; CN13.2 55.37,62.1 ; 55.37,62.1 55.37,55.88 55.12,55.63 53.83,55.63
$1N7021: length 96.7
  Top Layer w0.254: 52.2,67.34 52.22,67.32 CN11.1 ; 52.2,67.34 52.2,68.83 50.93,70.1 50.93,76.33 48.9,78.36 10.67,78.36 8.89,76.58 8.89,70.48 7.75,69.34 7.75,68.57 ; 52.2,67.34 52.2,60.8 ; CN9.1 7.73,62.1 7.75,62.12 ; CN8.1 7.74,68.57 7.75,68.57 ; 7.75,68.57 7.75,62.12 ; 7.75,62.12 7.75,56.01 7.36,55.62 CN10.1 ; CN12.1 53.81,54.36 52.58,54.36 52.2,54.74 52.2,60.8 ; 52.2,60.8 52.24,60.85 CN13.1
$1N7183: length 2.3
  Top Layer w0.254: LED1.2 56.19,49.77 R14.2

## Copper pours and planes (outline as drawn; the poured copper is in the pictures)
GND on Top Layer: 32.07,48.71 35.88,48.71 35.88,46.79 32.07,46.79
GND on Top Layer: -8,86.49 65.28,86.49 65.28,-4.44 -8,-4.44
GND on Bottom Layer: -3.43,82.17 78.1,82.17 78.1,-1.4 -3.43,-1.4
GND_BAT on Top Layer: 13.97,78.11 46.48,78.11 46.48,61.59 13.97,61.59
GND_BAT on Top Layer: 39.62,61.99 46.48,61.99 46.48,56.77 39.62,56.77
GND_BAT on Top Layer: 20.38,57.64 14.03,57.64 14.03,62.61 20.38,62.61
VCC_5V on Top Layer: 40.85,44.32 51.94,44.32 51.94,42.64 40.85,42.64
VCC_5V on Bottom Layer: 42.4,43.31 43.92,43.31 43.92,42.55 42.4,42.55
VCC_5V on Bottom Layer: 57.66,11.3 59.18,11.3 59.18,10.54 57.66,10.54
VCC_5V on Bottom Layer: 51.37,44.27 52.07,44.27 52.07,42.75 51.37,42.75
VCC_BAT on Top Layer: 7.75,78.11 13.97,78.11 13.97,58.08 7.75,58.08
VCC_BAT on Top Layer: 46.48,77.98 51.82,77.98 51.82,56.77 46.48,56.77
VCC_BAT on Bottom Layer: 9.91,78.75 49.52,78.75 50.21,78.06 50.21,56.76 39.62,56.76 39.62,61.72 19.94,61.72 19.94,56.77 9.91,56.77
VCC_IN on Top Layer: 32.07,52.45 34.04,52.45 34.04,49.05 32.07,49.05
VCC_IN on Top Layer: 31.62,56.9 34.67,56.9 34.67,52.2 31.62,52.2
VCC_IN on Top Layer: 31.93,52.7 34.04,52.7 34.04,50.97 31.93,50.97
SW on Top Layer: 18.29,50.93 29.97,50.93 29.97,47.75 18.29,47.75
SW on Top Layer: 28.83,49.78 30.79,49.78 30.79,47.75 28.83,47.75
$1N3528 on Top Layer: 31.51,44.32 34.42,44.32 34.42,38.36 31.51,38.36
$1N3528 on Top Layer: 18.29,41.15 33.31,41.15 33.31,36.7 18.29,36.7

Small or netless copper shapes (teardrops, artwork), in the pictures only: 185 on Top Layer, 14 on Bottom Layer

## Text on the board
Top Silkscreen Layer: JLCJLCJLCJLC | V-SCL-SDA-G | V-G-20-21 | V-8-9-G | TO-BOARD-C | ESP32-C3 | 23.12.29 | QW | Distribution.1.1 | INNOX2024W | V-0-1-2-3-G | RGB-10 | 5A@5V | ←→
